# EasyEDA Pro project firefly_xiao.eprj

# Schematic FireFly_xiao

## Sheets
1 PCA
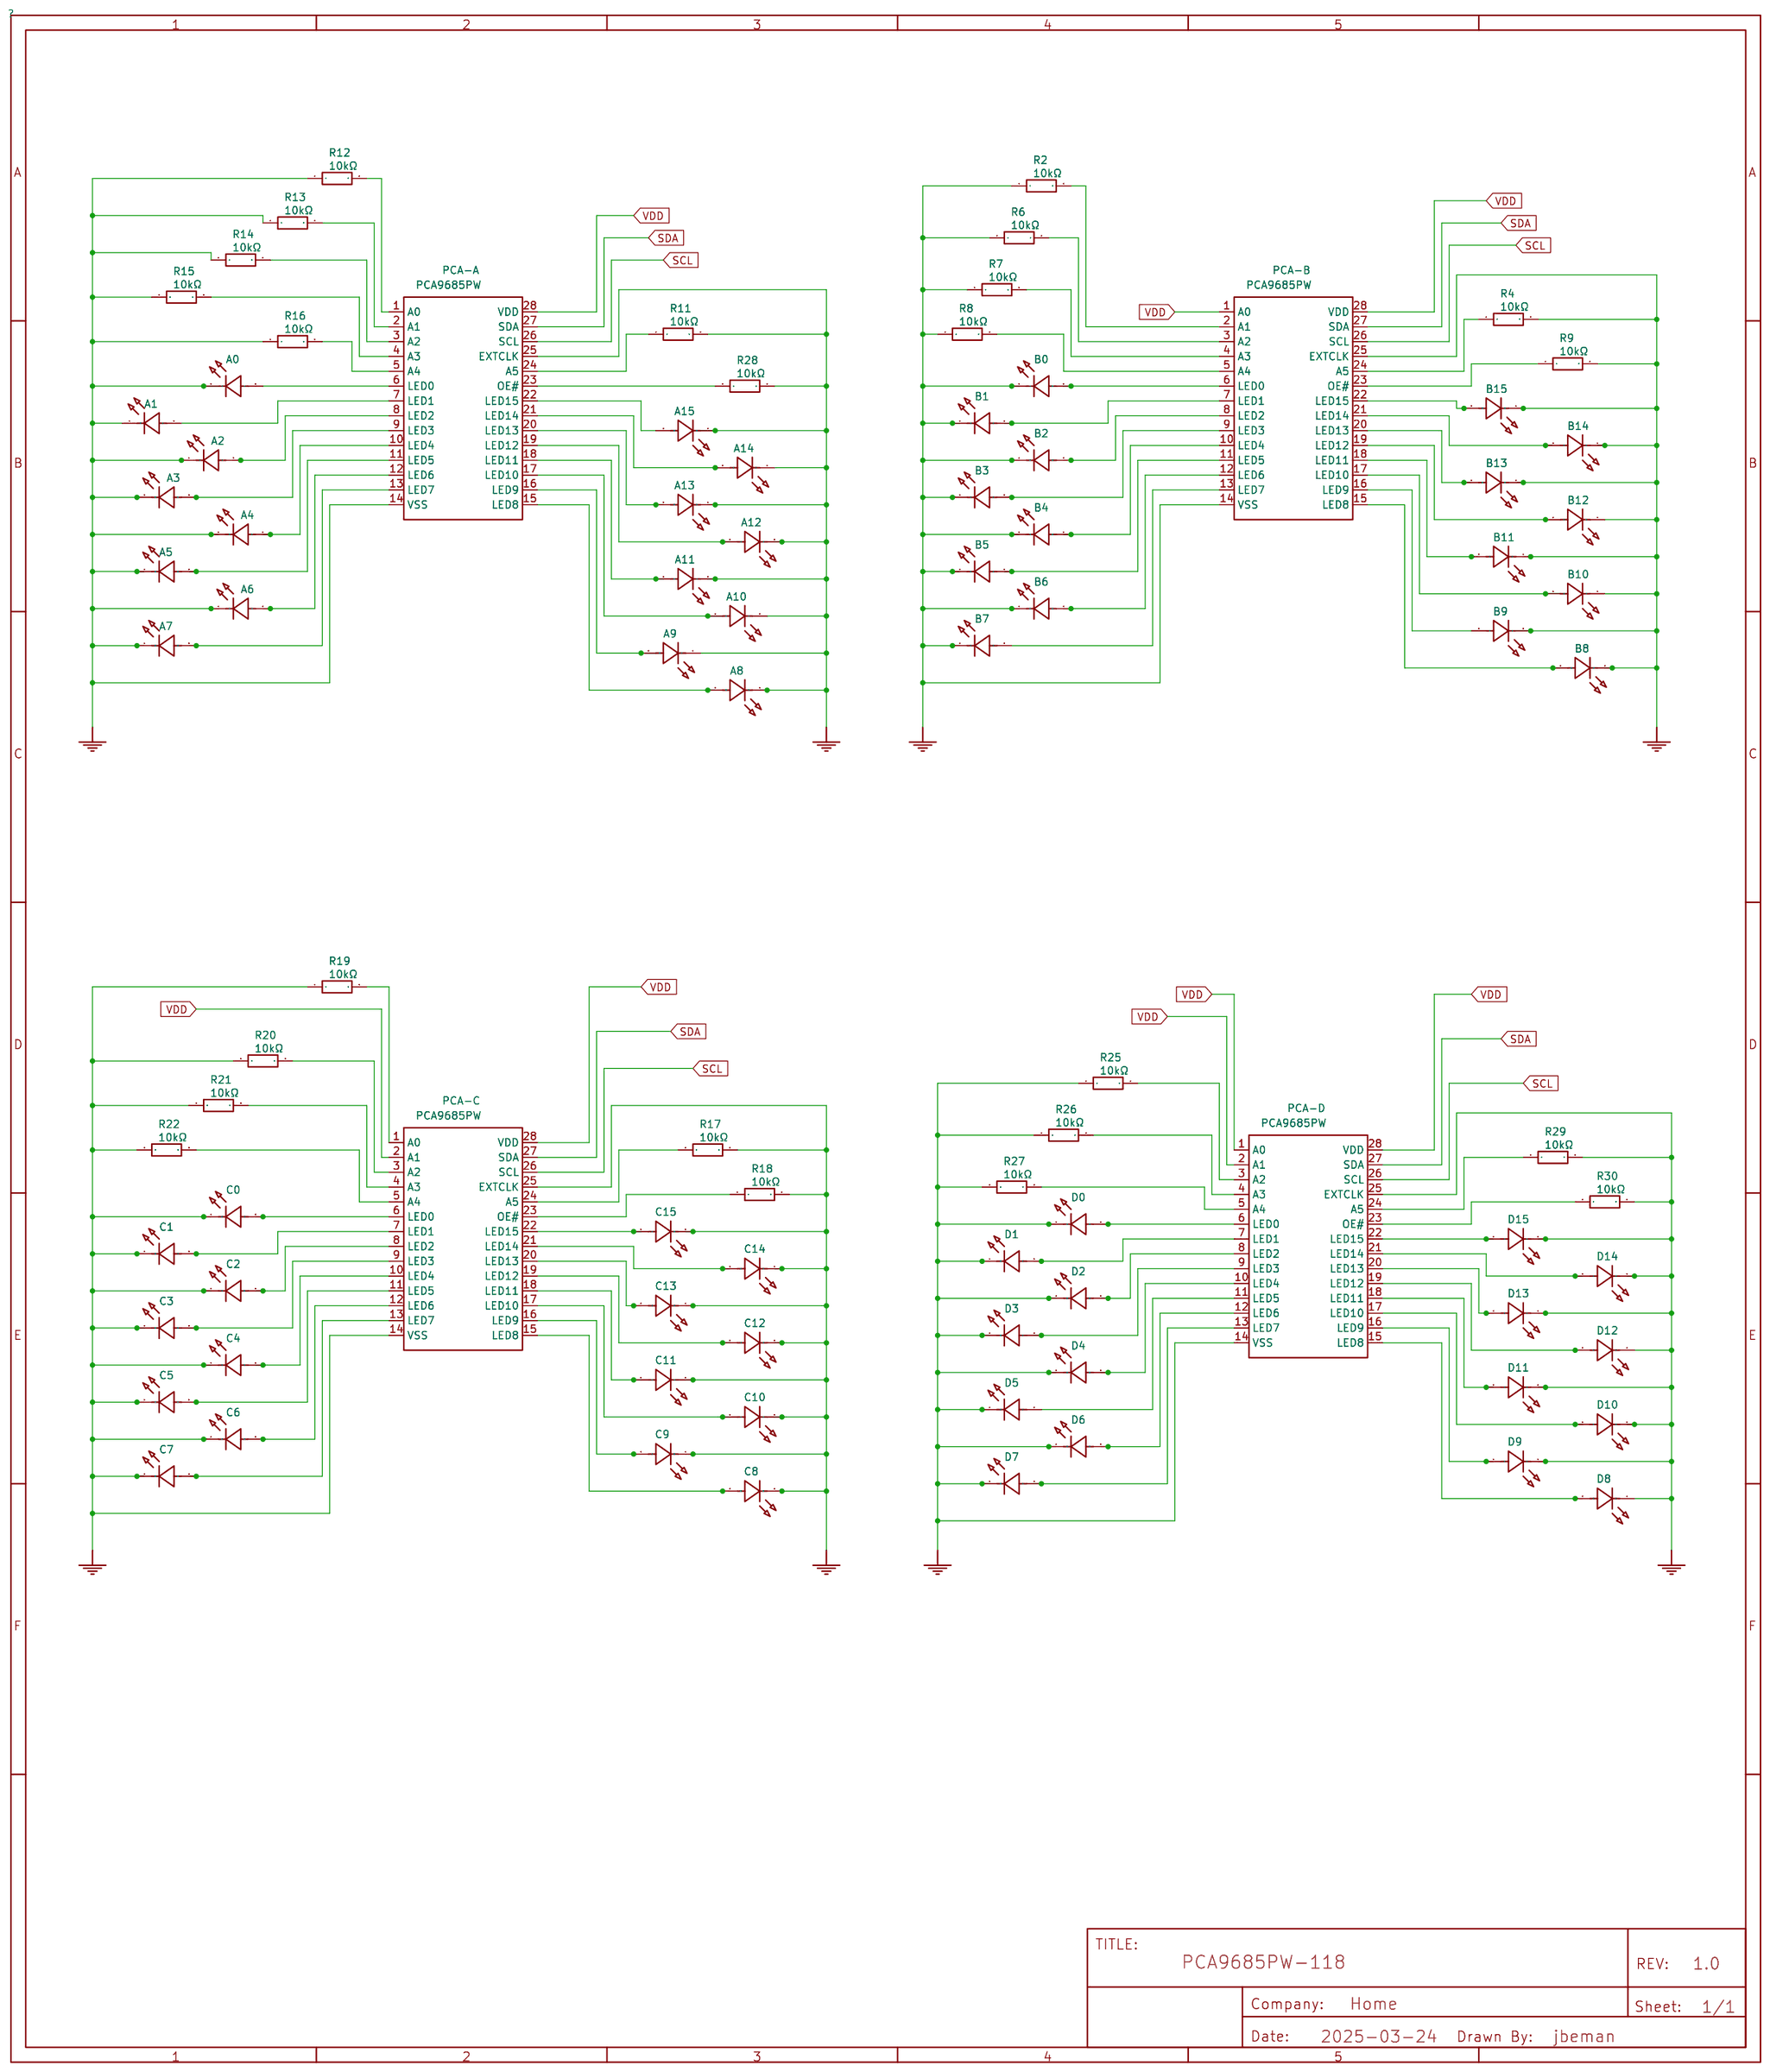
[diagram p0: PCA]
2 Controller: Board Name: FireFly_xiao; Create Date: 2026-03-09; Page Name: Controller; Project Name: firefly_xiao; Schematic Name: FireFly_xiao; Update Date: 2026-03-08; Add into BOM: yes; Company: Home; Convert to PCB: yes; Date: 2025-03-24; Draw By: jbeman; REV: 1.0; Sheet: 1/1; spicePre: .
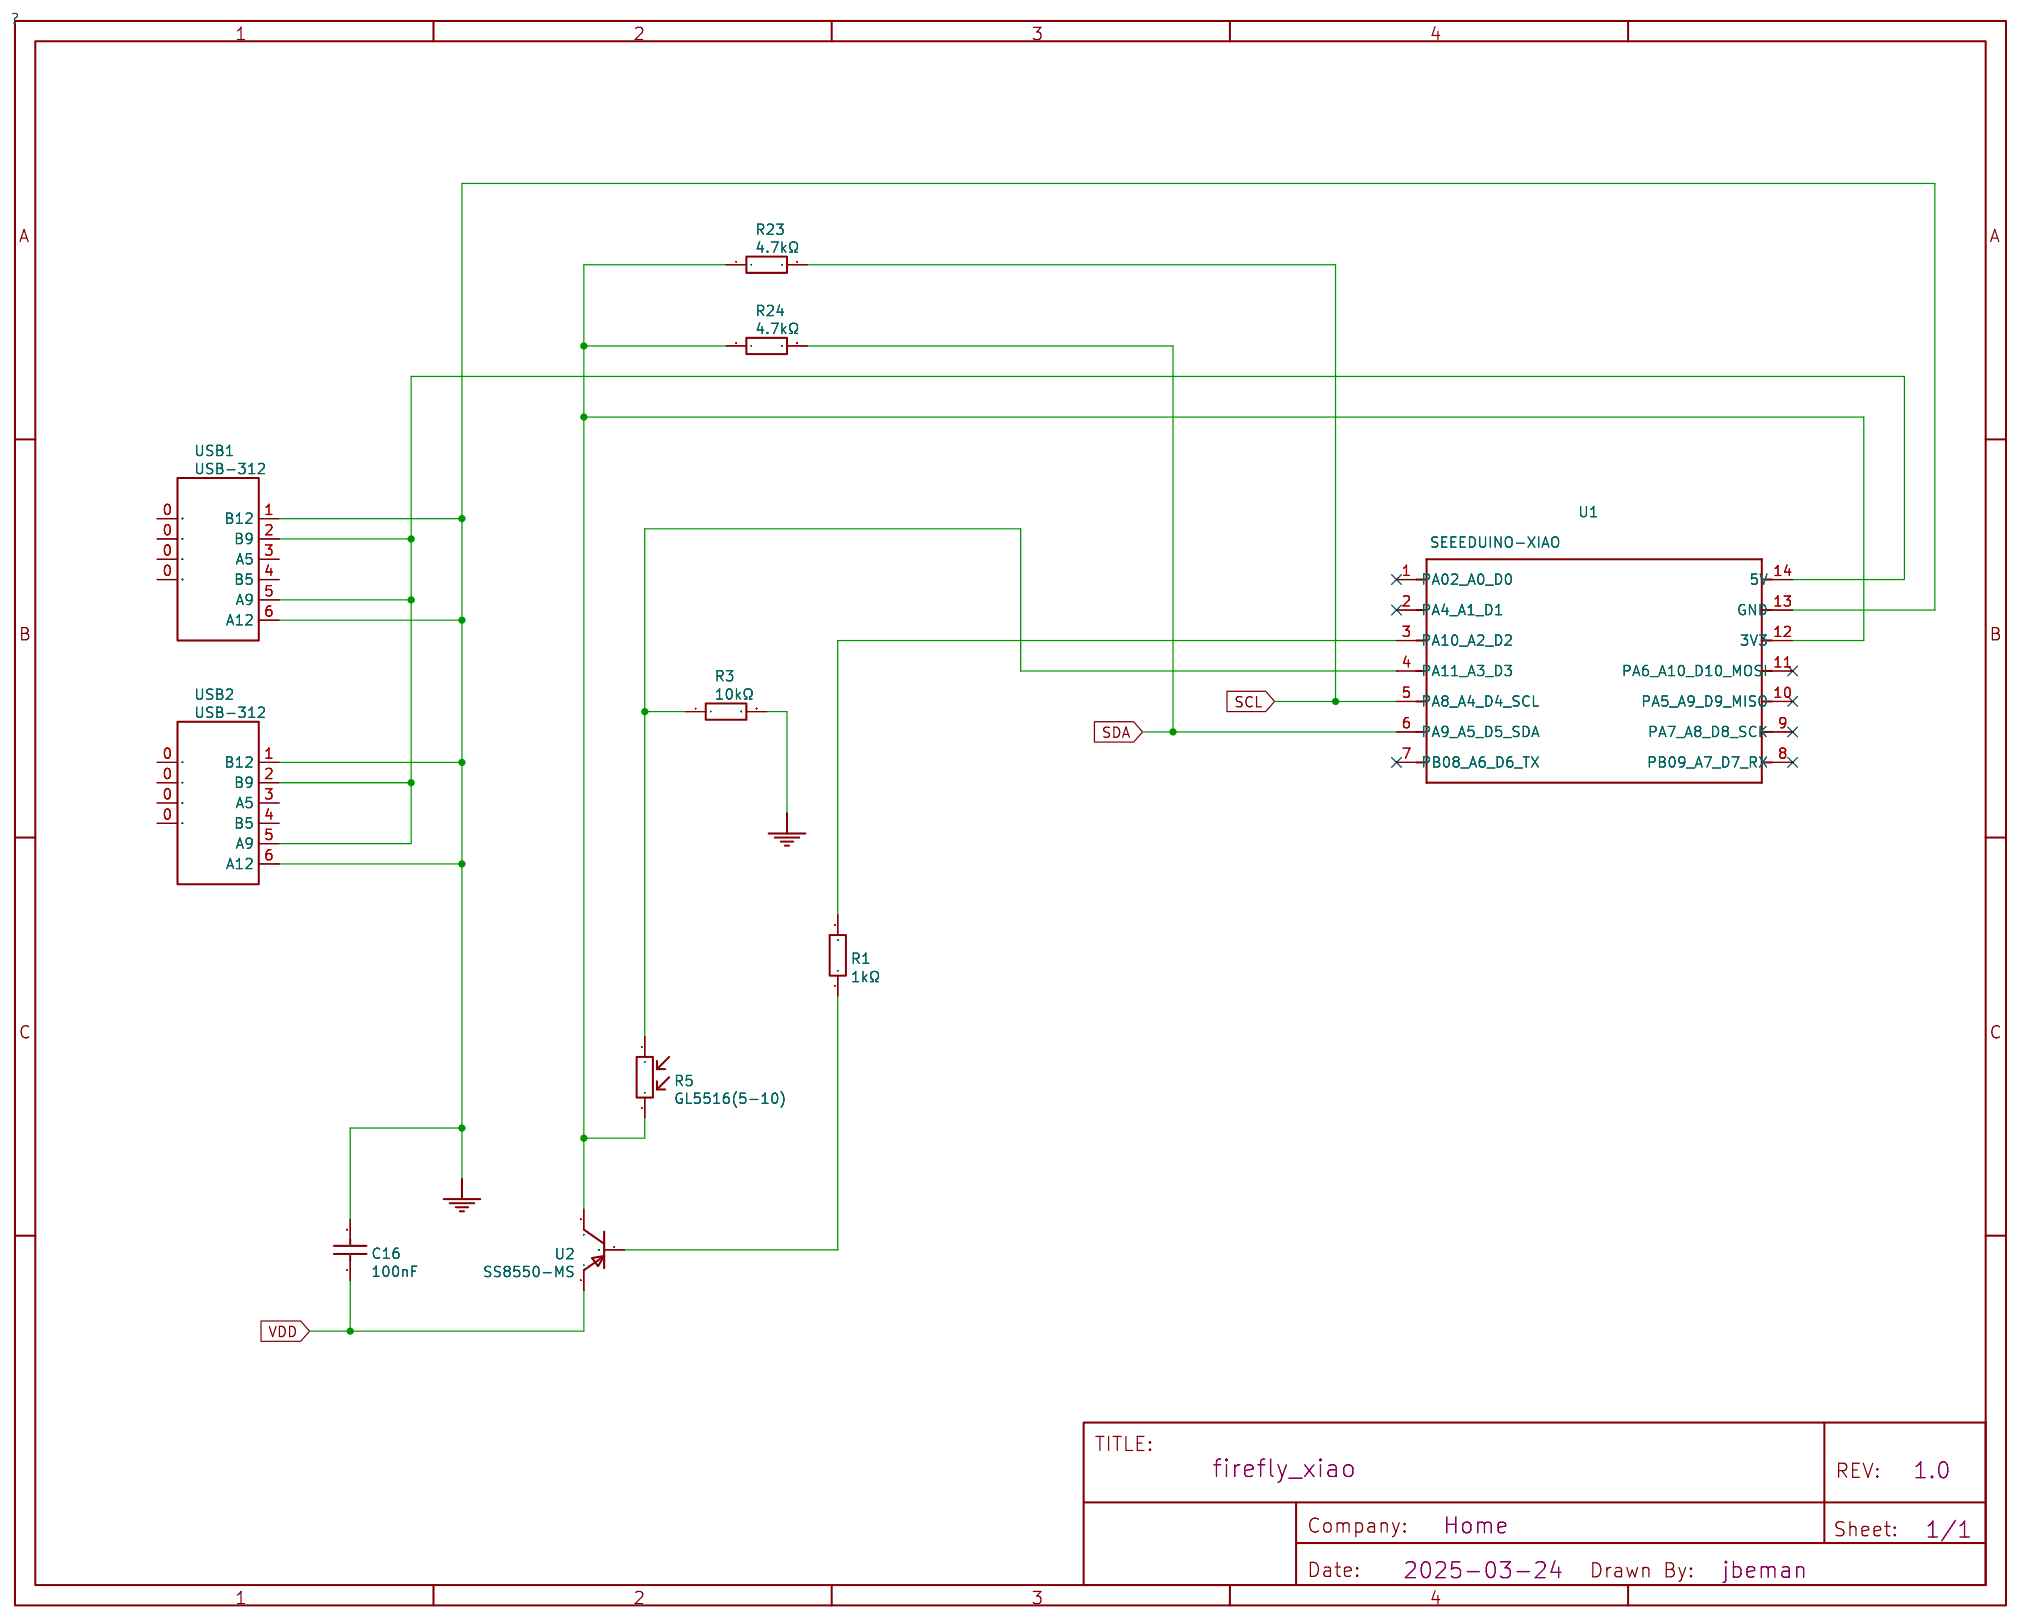
[diagram p1: Controller]

## Parts
sheet Controller
C16  100nF  [C0805]
R1  1kΩ  [R0805]
R3  10kΩ  [R0805]
R5  GL5516(5-10)  [RES-TH_L5.1-W4.3-P3.40_GL55]
R23  4.7kΩ  [R0805]
R24  4.7kΩ  [R0805]
U1  SEEEDUINO-XIAO  [MOUDLE14P-SMD-2.54-21X17.8MM]
U2  SS8550-MS  [SOT-23-3_L2.9-W1.3-P1.90-LS2.4-BR]
USB1  USB-312  [USB-C-SMD_10P-P1.00-L6.8-W8.9]
USB2  USB-312  [USB-C-SMD_10P-P1.00-L6.8-W8.9]
sheet PCA
A0  XL-2012WWC  [LED0805-RD_WHITE]
A1  XL-2012WWC  [LED0805-RD_WHITE]
A2  XL-2012WWC  [LED0805-RD_WHITE]
A3  XL-2012WWC  [LED0805-RD_WHITE]
A4  XL-2012WWC  [LED0805-RD_WHITE]
A5  XL-2012WWC  [LED0805-RD_WHITE]
A6  XL-2012WWC  [LED0805-RD_WHITE]
A7  XL-2012WWC  [LED0805-RD_WHITE]
A8  XL-2012WWC  [LED0805-RD_WHITE]
A9  XL-2012WWC  [LED0805-RD_WHITE]
A10  XL-2012WWC  [LED0805-RD_WHITE]
A11  XL-2012WWC  [LED0805-RD_WHITE]
A12  XL-2012WWC  [LED0805-RD_WHITE]
A13  XL-2012WWC  [LED0805-RD_WHITE]
A14  XL-2012WWC  [LED0805-RD_WHITE]
A15  XL-2012WWC  [LED0805-RD_WHITE]
B0  XL-2012WWC  [LED0805-RD_WHITE]
B1  XL-2012WWC  [LED0805-RD_WHITE]
B2  XL-2012WWC  [LED0805-RD_WHITE]
B3  XL-2012WWC  [LED0805-RD_WHITE]
B4  XL-2012WWC  [LED0805-RD_WHITE]
B5  XL-2012WWC  [LED0805-RD_WHITE]
B6  XL-2012WWC  [LED0805-RD_WHITE]
B7  XL-2012WWC  [LED0805-RD_WHITE]
B8  XL-2012WWC  [LED0805-RD_WHITE]
B9  XL-2012WWC  [LED0805-RD_WHITE]
B10  XL-2012WWC  [LED0805-RD_WHITE]
B11  XL-2012WWC  [LED0805-RD_WHITE]
B12  XL-2012WWC  [LED0805-RD_WHITE]
B13  XL-2012WWC  [LED0805-RD_WHITE]
B14  XL-2012WWC  [LED0805-RD_WHITE]
B15  XL-2012WWC  [LED0805-RD_WHITE]
C0  XL-2012WWC  [LED0805-RD_WHITE]
C1  XL-2012WWC  [LED0805-RD_WHITE]
C2  XL-2012WWC  [LED0805-RD_WHITE]
C3  XL-2012WWC  [LED0805-RD_WHITE]
C4  XL-2012WWC  [LED0805-RD_WHITE]
C5  XL-2012WWC  [LED0805-RD_WHITE]
C6  XL-2012WWC  [LED0805-RD_WHITE]
C7  XL-2012WWC  [LED0805-RD_WHITE]
C8  XL-2012WWC  [LED0805-RD_WHITE]
C9  XL-2012WWC  [LED0805-RD_WHITE]
C10  XL-2012WWC  [LED0805-RD_WHITE]
C11  XL-2012WWC  [LED0805-RD_WHITE]
C12  XL-2012WWC  [LED0805-RD_WHITE]
C13  XL-2012WWC  [LED0805-RD_WHITE]
C14  XL-2012WWC  [LED0805-RD_WHITE]
C15  XL-2012WWC  [LED0805-RD_WHITE]
D0  XL-2012WWC  [LED0805-RD_WHITE]
D1  XL-2012WWC  [LED0805-RD_WHITE]
D2  XL-2012WWC  [LED0805-RD_WHITE]
D3  XL-2012WWC  [LED0805-RD_WHITE]
D4  XL-2012WWC  [LED0805-RD_WHITE]
D5  XL-2012WWC  [LED0805-RD_WHITE]
D6  XL-2012WWC  [LED0805-RD_WHITE]
D7  XL-2012WWC  [LED0805-RD_WHITE]
D8  XL-2012WWC  [LED0805-RD_WHITE]
D9  XL-2012WWC  [LED0805-RD_WHITE]
D10  XL-2012WWC  [LED0805-RD_WHITE]
D11  XL-2012WWC  [LED0805-RD_WHITE]
D12  XL-2012WWC  [LED0805-RD_WHITE]
D13  XL-2012WWC  [LED0805-RD_WHITE]
D14  XL-2012WWC  [LED0805-RD_WHITE]
D15  XL-2012WWC  [LED0805-RD_WHITE]
PCA-A  PCA9685PW  [TSSOP-28_L9.7-W4.4-P0.65-LS6.4-TL]
PCA-B  PCA9685PW  [TSSOP-28_L9.7-W4.4-P0.65-LS6.4-TL]
PCA-C  PCA9685PW  [TSSOP-28_L9.7-W4.4-P0.65-LS6.4-TL]
PCA-D  PCA9685PW  [TSSOP-28_L9.7-W4.4-P0.65-LS6.4-TL]
R2  10kΩ  [R0805]
R4  10kΩ  [R0805]
R6  10kΩ  [R0805]
R7  10kΩ  [R0805]
R8  10kΩ  [R0805]
R9  10kΩ  [R0805]
R11  10kΩ  [R0805]
R12  10kΩ  [R0805]
R13  10kΩ  [R0805]
R14  10kΩ  [R0805]
R15  10kΩ  [R0805]
R16  10kΩ  [R0805]
R17  10kΩ  [R0805]
R18  10kΩ  [R0805]
R19  10kΩ  [R0805]
R20  10kΩ  [R0805]
R21  10kΩ  [R0805]
R22  10kΩ  [R0805]
R25  10kΩ  [R0805]
R26  10kΩ  [R0805]
R27  10kΩ  [R0805]
R28  10kΩ  [R0805]
R29  10kΩ  [R0805]
R30  10kΩ  [R0805]

## Library data of the parts
C16 = 100nF: Supplier: LCSC; Manufacturer Part: CL21B104KCFNNNE; Manufacturer: SAMSUNG(三星); Supplier Part: C28233; JLCPCB Part Class: Basic Part; nameAlias: Value; spicePre: C; spiceSymbolName: CL21B104KCFNNNE
R1 = 1kΩ: Supplier: LCSC; Manufacturer: UNI-ROYAL(厚声); Manufacturer Part: 0805W8F1001T5E; Supplier Part: C17513; JLCPCB Part Class: Basic Part; nameAlias: Value; spicePre: R; spiceSymbolName: 0805W8F1001T5E
R2-R4 R6-R9 R11-R22 R25-R30 = 10kΩ: Supplier: LCSC; Manufacturer: UNI-ROYAL(厚声); Manufacturer Part: 0805W8F1002T5E; Supplier Part: C17414; JLCPCB Part Class: Basic Part; nameAlias: Value; spicePre: R; spiceSymbolName: 0805W8F1002T5E
R5 = GL5516(5-10): Supplier: LCSC; Manufacturer: JCHL(晶创和立); Supplier Part: C10077; JLCPCB Part Class: Extended Part; spicePre: R
R23 R24 = 4.7kΩ: Supplier: LCSC; Manufacturer: UNI-ROYAL(厚声); Manufacturer Part: 0805W8F4701T5E; Supplier Part: C17673; JLCPCB Part Class: Basic Part; nameAlias: Value; spicePre: R; spiceSymbolName: 0805W8F4701T5E
U1 = SEEEDUINO-XIAO: Contributor: jbeman; spicePre: U; spiceSymbolName: MOUDLE-SEEEDUINO-XIAO-SMD
U2 = SS8550-MS: Supplier: LCSC; Supplier Part: C5120747; Manufacturer: MSKSEMI(美森科); JLCPCB Part Class: Extended Part; Contributor: lcsc; spicePre: U
USB1 USB2 = USB-312: Supplier: LCSC; Supplier Part: C309366; Manufacturer: HOOYA(皓宇电子); Manufacturer Part: USB-312-B-SU; JLCPCB Part Class: Extended Part; Contributor: LCSC; spicePre: U
A0-A15 B0-B15 C0-C15 D0-D15 = XL-2012WWC: Supplier: LCSC; Supplier Part: C965820; Manufacturer: XINGLIGHT(成兴光); JLCPCB Part Class: Extended Part; Contributor: lcsc; spicePre: L
PCA-A PCA-B PCA-C PCA-D = PCA9685PW: Supplier: LCSC; Supplier Part: C2678753; Manufacturer: NXP(恩智浦); Manufacturer Part: PCA9685PW,118; JLCPCB Part Class: Extended Part; Contributor: LCSC; nameAlias: Value; spicePre: U; spiceSymbolName: PCA9685PW,118

## Nets
GND: A0.1(K) A1.1(K) A2.1(K) A3.1(K) A4.1(K) A5.1(K) A6.1(K) A7.1(K) A8.1(K) A9.1(K) A10.1(K) A11.1(K) A12.1(K) A13.1(K) A14.1(K) A15.1(K) B0.1(K) B1.1(K) B2.1(K) B3.1(K) B4.1(K) B5.1(K) B6.1(K) B7.1(K) B8.1(K) B9.1(K) B10.1(K) B11.1(K) B12.1(K) B13.1(K) B14.1(K) B15.1(K) C0.1(K) C1.1(K) C2.1(K) C3.1(K) C4.1(K) C5.1(K) C6.1(K) C7.1(K) C8.1(K) C9.1(K) C10.1(K) C11.1(K) C12.1(K) C13.1(K) C14.1(K) C15.1(K) C16.2 D0.1(K) D1.1(K) D2.1(K) D3.1(K) D4.1(K) D5.1(K) D6.1(K) D7.1(K) D8.1(K) D9.1(K) D10.1(K) D11.1(K) D12.1(K) D13.1(K) D14.1(K) D15.1(K) PCA-A.14(VSS) PCA-A.25(EXTCLK) PCA-B.14(VSS) PCA-B.25(EXTCLK) PCA-C.14(VSS) PCA-C.25(EXTCLK) PCA-D.14(VSS) PCA-D.25(EXTCLK) R2.1 R3.2 R4.2 R6.1 R7.1 R8.1 R9.2 R11.2 R12.1 R13.1 R14.1 R15.1 R16.1 R17.2 R18.2 R19.1 R20.1 R21.1 R22.1 R25.1 R26.1 R27.1 R28.2 R29.2 R30.2 U1.13(GND) USB1.1(B12) USB1.6(A12) USB2.1(B12) USB2.6(A12)
VDD: C16.1 PCA-A.28(VDD) PCA-B.1(A0) PCA-B.28(VDD) PCA-C.2(A1) PCA-C.28(VDD) PCA-D.1(A0) PCA-D.2(A1) PCA-D.28(VDD) U2.2(E)
SCL: PCA-A.26(SCL) PCA-B.26(SCL) PCA-C.26(SCL) PCA-D.26(SCL) R23.2 U1.5(PA8_A4_D4_SCL)
SDA: PCA-A.27(SDA) PCA-B.27(SDA) PCA-C.27(SDA) PCA-D.27(SDA) R24.2 U1.6(PA9_A5_D5_SDA)
PCA-A_1: PCA-A.1(A0) R12.2
PCA-A_2: PCA-A.2(A1) R13.2
PCA-A_3: PCA-A.3(A2) R14.2
PCA-A_4: PCA-A.4(A3) R15.2
PCA-A_5: PCA-A.5(A4) R16.2
PCA-A_6: A0.2(A) PCA-A.6(LED0)
PCA-A_7: A1.2(A) PCA-A.7(LED1)
PCA-A_8: A2.2(A) PCA-A.8(LED2)
PCA-A_9: A3.2(A) PCA-A.9(LED3)
PCA-A_10: A4.2(A) PCA-A.10(LED4)
PCA-A_11: A5.2(A) PCA-A.11(LED5)
PCA-A_12: A6.2(A) PCA-A.12(LED6)
PCA-A_13: A7.2(A) PCA-A.13(LED7)
PCA-A_15: A8.2(A) PCA-A.15(LED8)
PCA-A_16: A9.2(A) PCA-A.16(LED9)
PCA-A_17: A10.2(A) PCA-A.17(LED10)
PCA-A_18: A11.2(A) PCA-A.18(LED11)
PCA-A_19: A12.2(A) PCA-A.19(LED12)
PCA-A_20: A13.2(A) PCA-A.20(LED13)
PCA-A_21: A14.2(A) PCA-A.21(LED14)
PCA-A_22: A15.2(A) PCA-A.22(LED15)
PCA-A_23: PCA-A.23(OE#) R28.1
PCA-A_24: PCA-A.24(A5) R11.1
PCA-B_2: PCA-B.2(A1) R2.2
PCA-B_3: PCA-B.3(A2) R6.2
PCA-B_4: PCA-B.4(A3) R7.2
PCA-B_5: PCA-B.5(A4) R8.2
PCA-B_6: B0.2(A) PCA-B.6(LED0)
PCA-B_7: B1.2(A) PCA-B.7(LED1)
PCA-B_8: B2.2(A) PCA-B.8(LED2)
PCA-B_9: B3.2(A) PCA-B.9(LED3)
PCA-B_10: B4.2(A) PCA-B.10(LED4)
PCA-B_11: B5.2(A) PCA-B.11(LED5)
PCA-B_12: B6.2(A) PCA-B.12(LED6)
PCA-B_13: B7.2(A) PCA-B.13(LED7)
PCA-B_15: B8.2(A) PCA-B.15(LED8)
PCA-B_16: B9.2(A) PCA-B.16(LED9)
PCA-B_17: B10.2(A) PCA-B.17(LED10)
PCA-B_18: B11.2(A) PCA-B.18(LED11)
PCA-B_19: B12.2(A) PCA-B.19(LED12)
PCA-B_20: B13.2(A) PCA-B.20(LED13)
PCA-B_21: B14.2(A) PCA-B.21(LED14)
PCA-B_22: B15.2(A) PCA-B.22(LED15)
PCA-B_23: PCA-B.23(OE#) R9.1
PCA-B_24: PCA-B.24(A5) R4.1
PCA-C_1: PCA-C.1(A0) R19.2
PCA-C_3: PCA-C.3(A2) R20.2
PCA-C_4: PCA-C.4(A3) R21.2
PCA-C_5: PCA-C.5(A4) R22.2
PCA-C_6: C0.2(A) PCA-C.6(LED0)
PCA-C_7: C1.2(A) PCA-C.7(LED1)
PCA-C_8: C2.2(A) PCA-C.8(LED2)
PCA-C_9: C3.2(A) PCA-C.9(LED3)
PCA-C_10: C4.2(A) PCA-C.10(LED4)
PCA-C_11: C5.2(A) PCA-C.11(LED5)
PCA-C_12: C6.2(A) PCA-C.12(LED6)
PCA-C_13: C7.2(A) PCA-C.13(LED7)
PCA-C_15: C8.2(A) PCA-C.15(LED8)
PCA-C_16: C9.2(A) PCA-C.16(LED9)
PCA-C_17: C10.2(A) PCA-C.17(LED10)
PCA-C_18: C11.2(A) PCA-C.18(LED11)
PCA-C_19: C12.2(A) PCA-C.19(LED12)
PCA-C_20: C13.2(A) PCA-C.20(LED13)
PCA-C_21: C14.2(A) PCA-C.21(LED14)
PCA-C_22: C15.2(A) PCA-C.22(LED15)
PCA-C_23: PCA-C.23(OE#) R18.1
PCA-C_24: PCA-C.24(A5) R17.1
PCA-D_3: PCA-D.3(A2) R25.2
PCA-D_4: PCA-D.4(A3) R26.2
PCA-D_5: PCA-D.5(A4) R27.2
PCA-D_6: D0.2(A) PCA-D.6(LED0)
PCA-D_7: D1.2(A) PCA-D.7(LED1)
PCA-D_8: D2.2(A) PCA-D.8(LED2)
PCA-D_9: D3.2(A) PCA-D.9(LED3)
PCA-D_10: D4.2(A) PCA-D.10(LED4)
PCA-D_11: D5.2(A) PCA-D.11(LED5)
PCA-D_12: D6.2(A) PCA-D.12(LED6)
PCA-D_13: D7.2(A) PCA-D.13(LED7)
PCA-D_15: D8.2(A) PCA-D.15(LED8)
PCA-D_16: D9.2(A) PCA-D.16(LED9)
PCA-D_17: D10.2(A) PCA-D.17(LED10)
PCA-D_18: D11.2(A) PCA-D.18(LED11)
PCA-D_19: D12.2(A) PCA-D.19(LED12)
PCA-D_20: D13.2(A) PCA-D.20(LED13)
PCA-D_21: D14.2(A) PCA-D.21(LED14)
PCA-D_22: D15.2(A) PCA-D.22(LED15)
PCA-D_23: PCA-D.23(OE#) R30.1
PCA-D_24: PCA-D.24(A5) R29.1
R1_2: R1.2 U1.3(PA10_A2_D2)
R5_1: R3.1 R5.1 U1.4(PA11_A3_D3)
R5_2: R5.2 R23.1 R24.1 U1.12(3V3) U2.3(C)
U2_1: R1.1 U2.1(B)
USB1_2: U1.14(5V) USB1.2(B9) USB1.5(A9) USB2.2(B9) USB2.5(A9)

Not connected (* = marked no-connect by the designer): U1 1(PA02_A0_D0)* 2(PA4_A1_D1)* 7(PB08_A6_D6_TX)* 8(PB09_A7_D7_RX)* 9(PA7_A8_D8_SCK)* 10(PA5_A9_D9_MISO)* 11(PA6_A10_D10_MOSI)*; USB1 0 3(A5) 4(B5); USB2 0 3(A5) 4(B5)

# Board 1-PCB_PCB_FireFly_xiao
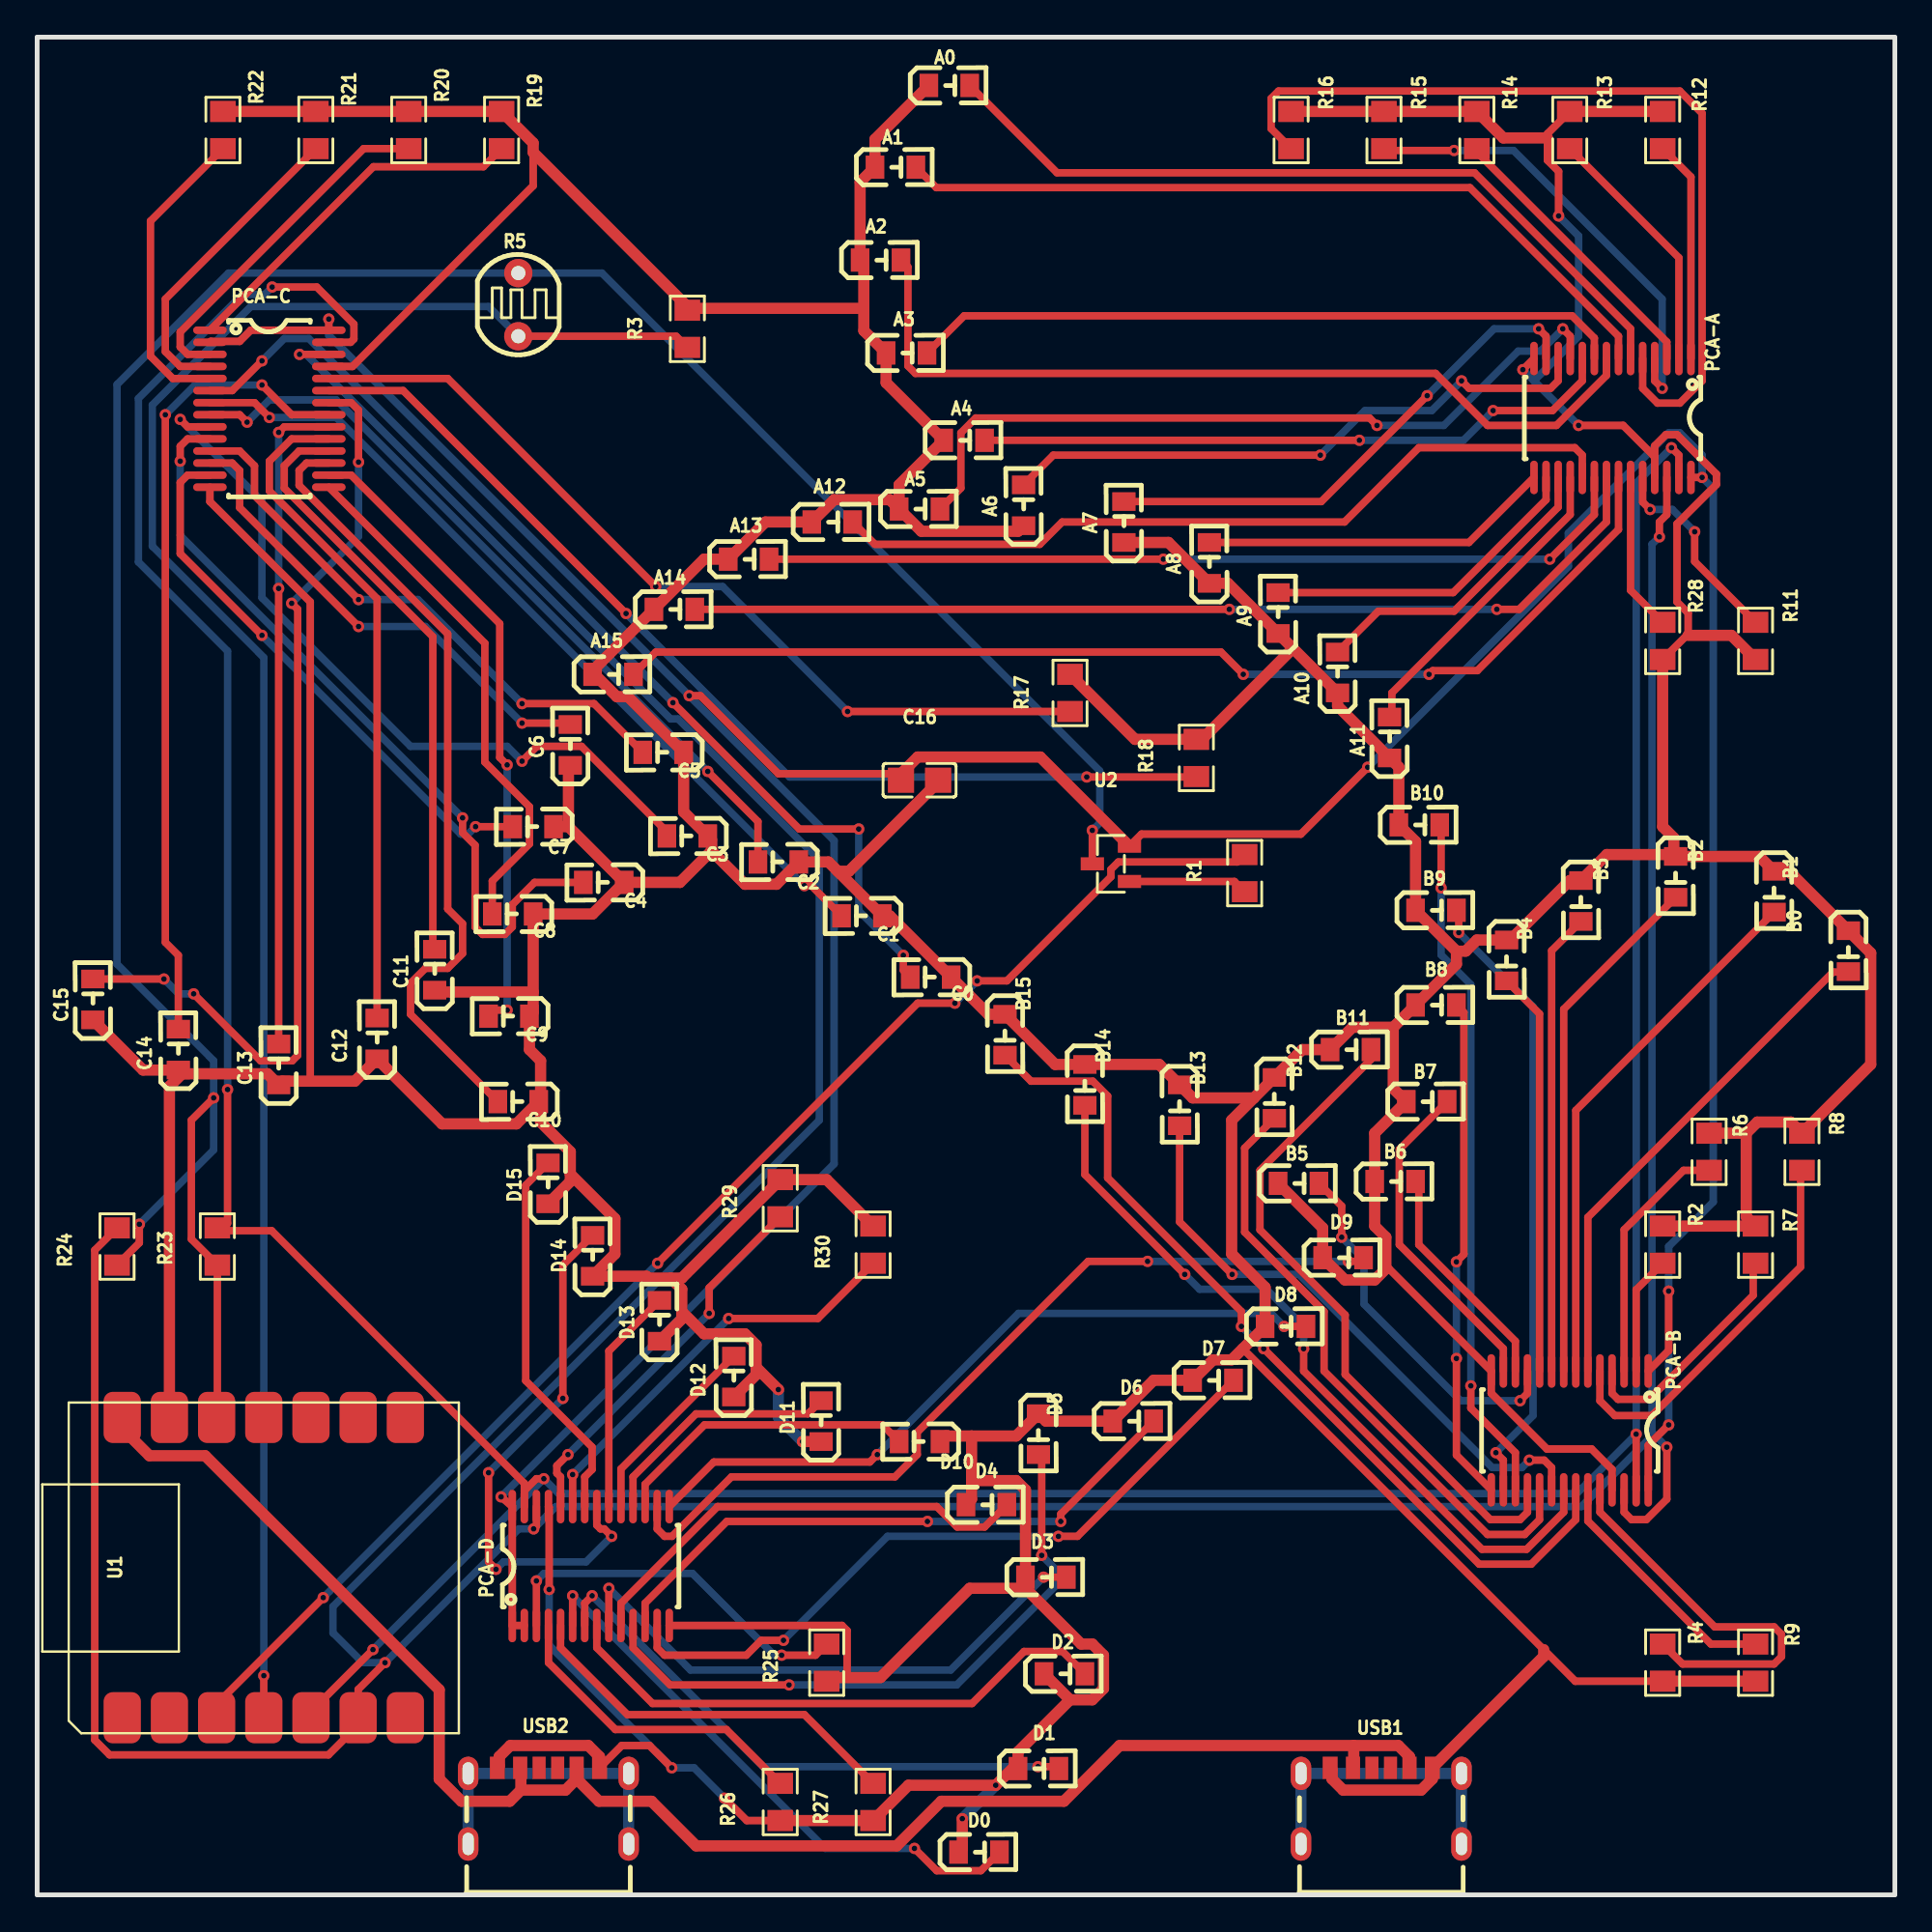
[diagram p2: board, top side]
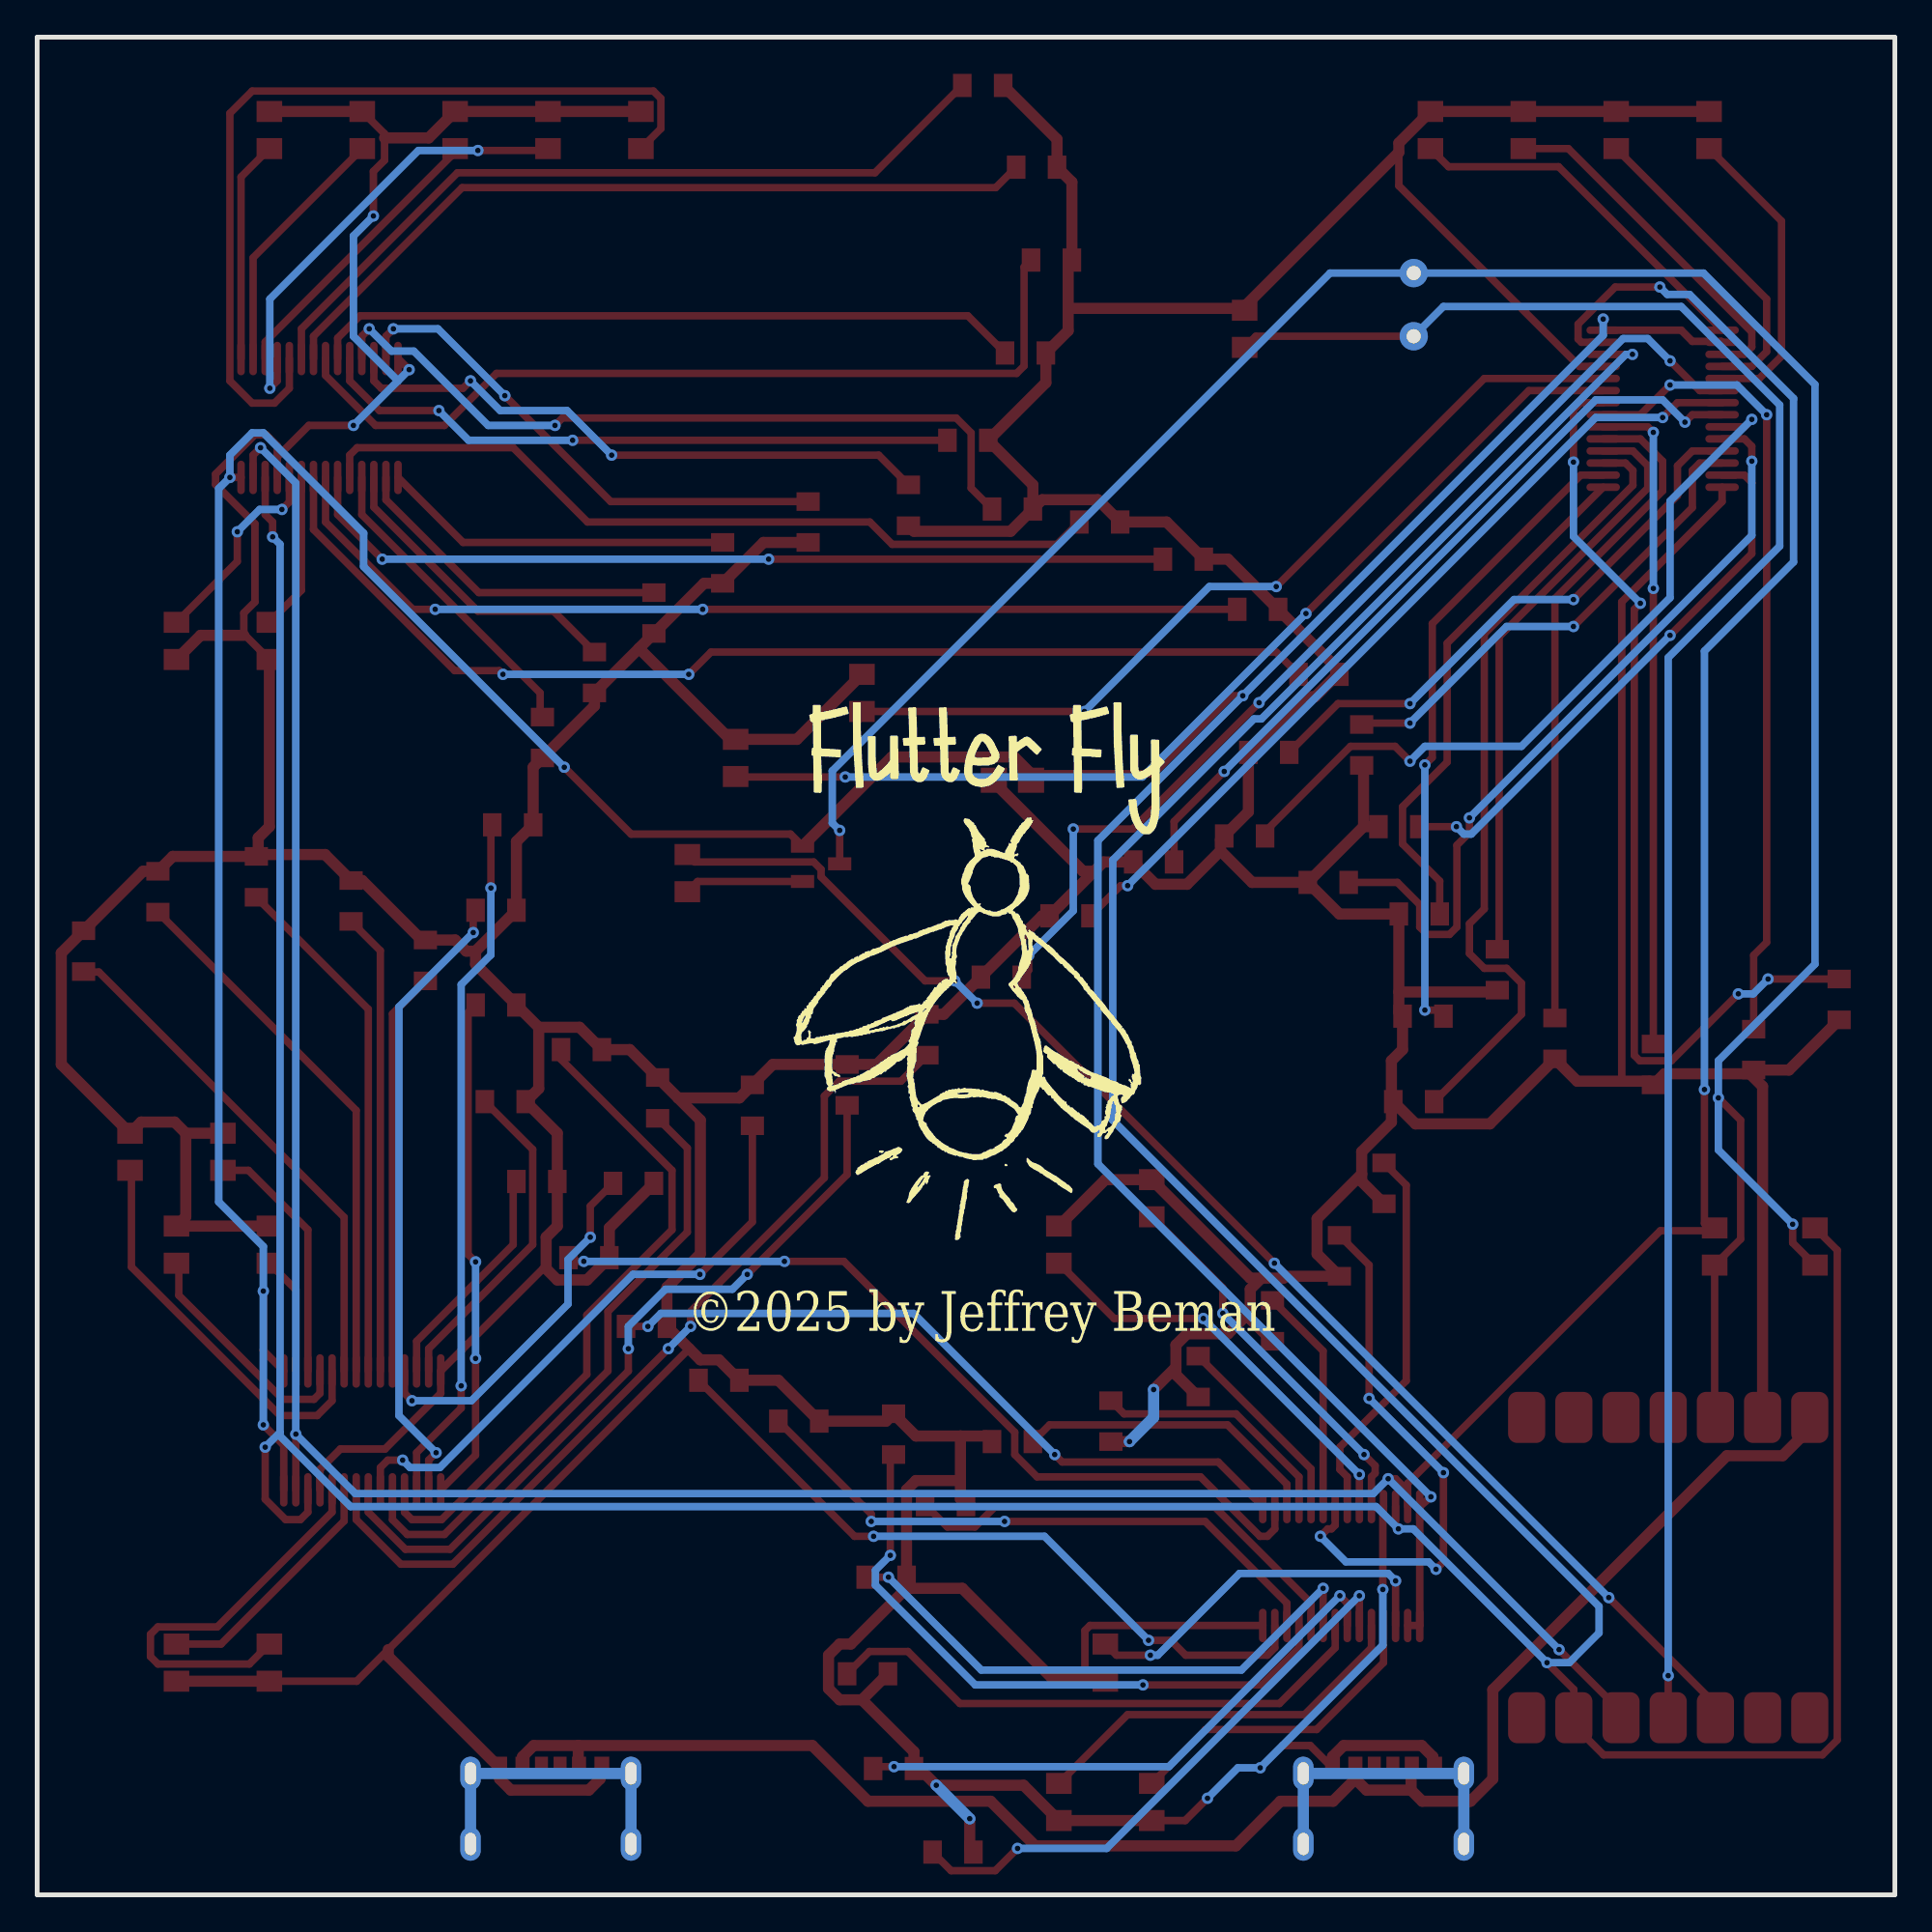
[diagram p3: board, bottom side, seen from below]

Outline 100 x 100 mm; copper layers: Top Layer, Bottom Layer. Coordinates in mm from the lower left corner of the outline.
Outline path: 0,100 100,100 100,0 0,0 0,100
Stack: Top Layer 0.035mm / Dielectric1 1.51mm FR4 er 4.5 / Bottom Layer 0.035mm

## Design rules (mm)
template: User Custom Config
spacing Default (default): track to track 0.102, other pairs 0.152 to 0.3
track width Default (default): min 0.127, default 0.4, max 2.54
track width PowerTrack: min 0.4, default 0.6, max 2.54
differential pair differentialPair (default): width min 0.127, default 0.254, max 2.54; gap min 0.152, default 0.152
via Default (default): diameter min 0.61, default 0.61, max 100.025; hole min 0.305, default 0.305, max 59.995
net GND uses PowerTrack
net VDD uses PowerTrack
net USB2_0 uses PowerTrack
net USB1_0 uses PowerTrack
net USB1_2 uses PowerTrack
net USB1_4 uses PowerTrack
net USB1_3 uses PowerTrack
net USB2_4 uses PowerTrack
net USB2_3 uses PowerTrack

## Placement (name value [footprint] x y rotation side)
A0  XL-2012WWC  [LED0805-RD_WHITE]  49.1 97.4 0 top
A1  XL-2012WWC  [LED0805-RD_WHITE]  46.2 93 0 top
A2  XL-2012WWC  [LED0805-RD_WHITE]  45.4 88 0 top
A3  XL-2012WWC  [LED0805-RD_WHITE]  46.8 83 0 top
A4  XL-2012WWC  [LED0805-RD_WHITE]  49.9 78.3 0 top
A5  XL-2012WWC  [LED0805-RD_WHITE]  47.5 74.6 0 top
A6  XL-2012WWC  [LED0805-RD_WHITE]  53.1 74.8 90 top
A7  XL-2012WWC  [LED0805-RD_WHITE]  58.5 73.9 90 top
A8  XL-2012WWC  [LED0805-RD_WHITE]  63.1 71.7 90 top
A9  XL-2012WWC  [LED0805-RD_WHITE]  66.8 69 90 top
A10  XL-2012WWC  [LED0805-RD_WHITE]  70 65.8 90 top
A11  XL-2012WWC  [LED0805-RD_WHITE]  72.8 62.3 90 top
A12  XL-2012WWC  [LED0805-RD_WHITE]  42.8 73.9 0 top
A13  XL-2012WWC  [LED0805-RD_WHITE]  38.3 71.9 0 top
A14  XL-2012WWC  [LED0805-RD_WHITE]  34.3 69.2 0 top
A15  XL-2012WWC  [LED0805-RD_WHITE]  31 65.7 0 top
B0  XL-2012WWC  [LED0805-RD_WHITE]  97.5 50.8 270 top
B1  XL-2012WWC  [LED0805-RD_WHITE]  93.5 54 270 top
B2  XL-2012WWC  [LED0805-RD_WHITE]  88.2 54.8 270 top
B3  XL-2012WWC  [LED0805-RD_WHITE]  83.1 53.5 270 top
B4  XL-2012WWC  [LED0805-RD_WHITE]  79.1 50.3 270 top
B5  XL-2012WWC  [LED0805-RD_WHITE]  67.9 38.3 0 top
B6  XL-2012WWC  [LED0805-RD_WHITE]  73.1 38.4 0 top
B7  XL-2012WWC  [LED0805-RD_WHITE]  74.8 42.7 0 top
B8  XL-2012WWC  [LED0805-RD_WHITE]  75.3 47.9 0 top
B9  XL-2012WWC  [LED0805-RD_WHITE]  75.3 53 0 top
B10  XL-2012WWC  [LED0805-RD_WHITE]  74.4 57.6 0 top
B11  XL-2012WWC  [LED0805-RD_WHITE]  70.7 45.5 0 top
B12  XL-2012WWC  [LED0805-RD_WHITE]  66.6 42.9 270 top
B13  XL-2012WWC  [LED0805-RD_WHITE]  61.5 42.5 270 top
B14  XL-2012WWC  [LED0805-RD_WHITE]  56.4 43.6 270 top
B15  XL-2012WWC  [LED0805-RD_WHITE]  52.1 46.3 270 top
C0  XL-2012WWC  [LED0805-RD_WHITE]  48.1 49.4 180 top
C1  XL-2012WWC  [LED0805-RD_WHITE]  44.4 52.7 180 top
C2  XL-2012WWC  [LED0805-RD_WHITE]  39.9 55.6 180 top
C3  XL-2012WWC  [LED0805-RD_WHITE]  35 57 180 top
C4  XL-2012WWC  [LED0805-RD_WHITE]  30.5 54.5 180 top
C5  XL-2012WWC  [LED0805-RD_WHITE]  33.7 61.5 180 top
C6  XL-2012WWC  [LED0805-RD_WHITE]  28.7 61.9 90 top
C7  XL-2012WWC  [LED0805-RD_WHITE]  26.7 57.5 180 top
C8  XL-2012WWC  [LED0805-RD_WHITE]  25.6 52.8 180 top
C9  XL-2012WWC  [LED0805-RD_WHITE]  25.4 47.3 180 top
C10  XL-2012WWC  [LED0805-RD_WHITE]  25.9 42.7 180 top
C11  XL-2012WWC  [LED0805-RD_WHITE]  21.4 49.8 90 top
C12  XL-2012WWC  [LED0805-RD_WHITE]  18.3 46.1 90 top
C13  XL-2012WWC  [LED0805-RD_WHITE]  13 44.7 90 top
C14  XL-2012WWC  [LED0805-RD_WHITE]  7.6 45.5 90 top
C15  XL-2012WWC  [LED0805-RD_WHITE]  3 48.2 90 top
C16  100nF  [C0805]  47.5 60 0 top
D0  XL-2012WWC  [LED0805-RD_WHITE]  50.7 2.3 0 top
D1  XL-2012WWC  [LED0805-RD_WHITE]  53.9 6.8 0 top
D2  XL-2012WWC  [LED0805-RD_WHITE]  55.3 11.9 0 top
D3  XL-2012WWC  [LED0805-RD_WHITE]  54.3 17.1 0 top
D4  XL-2012WWC  [LED0805-RD_WHITE]  51.1 21 0 top
D5  XL-2012WWC  [LED0805-RD_WHITE]  53.9 24.8 270 top
D6  XL-2012WWC  [LED0805-RD_WHITE]  59 25.5 0 top
D7  XL-2012WWC  [LED0805-RD_WHITE]  63.3 27.7 0 top
D8  XL-2012WWC  [LED0805-RD_WHITE]  67.2 30.6 0 top
D9  XL-2012WWC  [LED0805-RD_WHITE]  70.3 34.3 0 top
D10  XL-2012WWC  [LED0805-RD_WHITE]  47.5 24.4 180 top
D11  XL-2012WWC  [LED0805-RD_WHITE]  42.2 25.5 90 top
D12  XL-2012WWC  [LED0805-RD_WHITE]  37.5 27.9 90 top
D13  XL-2012WWC  [LED0805-RD_WHITE]  33.5 30.9 90 top
D14  XL-2012WWC  [LED0805-RD_WHITE]  29.9 34.4 90 top
D15  XL-2012WWC  [LED0805-RD_WHITE]  27.5 38.3 90 top
PCA-A  PCA9685PW  [TSSOP-28_L9.7-W4.4-P0.65-LS6.4-TL]  84.8 79.5 270 top
PCA-B  PCA9685PW  [TSSOP-28_L9.7-W4.4-P0.65-LS6.4-TL]  82.5 25 270 top
PCA-C  PCA9685PW  [TSSOP-28_L9.7-W4.4-P0.65-LS6.4-TL]  12.5 80 0 top
PCA-D  PCA9685PW  [TSSOP-28_L9.7-W4.4-P0.65-LS6.4-TL]  29.8 17.7 90 top
R1  1kΩ  [R0805]  65 55 90 top
R2  10kΩ  [R0805]  87.5 35 270 top
R3  10kΩ  [R0805]  35 84.3 90 top
R4  10kΩ  [R0805]  87.5 12.5 270 top
R5  GL5516(5-10)  [RES-TH_L5.1-W4.3-P3.40_GL55]  25.9 85.6 180 top
R6  10kΩ  [R0805]  90 40 270 top
R7  10kΩ  [R0805]  92.5 35 270 top
R8  10kΩ  [R0805]  95 40 270 top
R9  10kΩ  [R0805]  92.5 12.5 270 top
R11  10kΩ  [R0805]  92.5 67.5 270 top
R12  10kΩ  [R0805]  87.5 95 270 top
R13  10kΩ  [R0805]  82.5 95 270 top
R14  10kΩ  [R0805]  77.5 95 270 top
R15  10kΩ  [R0805]  72.5 95 270 top
R16  10kΩ  [R0805]  67.5 95 270 top
R17  10kΩ  [R0805]  55.6 64.7 90 top
R18  10kΩ  [R0805]  62.4 61.2 90 top
R19  10kΩ  [R0805]  25 95 270 top
R20  10kΩ  [R0805]  20 95 270 top
R21  10kΩ  [R0805]  15 95 270 top
R22  10kΩ  [R0805]  10 95 270 top
R23  4.7kΩ  [R0805]  9.7 34.9 90 top
R24  4.7kΩ  [R0805]  4.3 34.9 90 top
R25  10kΩ  [R0805]  42.5 12.5 90 top
R26  10kΩ  [R0805]  40 5 90 top
R27  10kΩ  [R0805]  45 5 90 top
R28  10kΩ  [R0805]  87.5 67.5 270 top
R29  10kΩ  [R0805]  40 37.5 90 top
R30  10kΩ  [R0805]  45 35 90 top
U1  SEEEDUINO-XIAO  [MOUDLE14P-SMD-2.54-21X17.8MM]  22.7 8.7 90 top
U2  SS8550-MS  [SOT-23-3_L2.9-W1.3-P1.90-LS2.4-BR]  57.8 55.5 0 top
USB1  USB-312  [USB-C-SMD_10P-P1.00-L6.8-W8.9]  72.35 4.79 0 top
USB2  USB-312  [USB-C-SMD_10P-P1.00-L6.8-W8.9]  27.52 4.79 0 top

## Footprints (pads in the part's own frame, mm; a bottom-side part is the same pattern mirrored in y, then rotated)
C0805
  rect 1.41x1.35 smd: 1(-1,0) 2(1,0)
LED0805-RD_WHITE
  rect 1x1.25 smd: 1(-1.1,0) 2(1.1,0)
MOUDLE14P-SMD-2.54-21X17.8MM
  custom 2.75x2 smd: 1(0.835,18.12) 2(0.835,15.58) 3(0.835,13.04) 4(0.835,10.5) 5(0.835,7.96) 6(0.835,5.42) 7(0.835,2.88) 8(17,2.88) 9(17,5.42) 10(17,7.96) 11(17,10.5) 12(17,13.04) 13(17,15.58) 14(17,18.12)
R0805
  rect 1.133x1.377 smd: 1(-1,0) 2(1,0)
RES-TH_L5.1-W4.3-P3.40_GL55
  round 1.524 hole 0.762: 1(0,1.7) 2(0,-1.7)
SOT-23-3_L2.9-W1.3-P1.90-LS2.4-BR
  rect 1.25x0.7 smd: 1(1,-0.95) 2(1,0.95) 3(-1,0)
TSSOP-28_L9.7-W4.4-P0.65-LS6.4-TL
  oval 1.804x0.406 smd: 1(-3.2,4.225) 2(-3.2,3.575) 3(-3.2,2.925) 4(-3.2,2.275) 5(-3.2,1.625) 6(-3.2,0.975) 7(-3.2,0.325) 8(-3.2,-0.325) 9(-3.2,-0.975) 10(-3.2,-1.625) 11(-3.2,-2.275) 12(-3.2,-2.925) 13(-3.2,-3.575) 14(-3.2,-4.225) 15(3.2,-4.225) 16(3.2,-3.575) 17(3.2,-2.925) 18(3.2,-2.275) 19(3.2,-1.625) 20(3.2,-0.975) 21(3.2,-0.325) 22(3.2,0.325) 23(3.2,0.975) 24(3.2,1.625) 25(3.2,2.275) 26(3.2,2.925) 27(3.2,3.575) 28(3.2,4.225)
USB-C-SMD_10P-P1.00-L6.8-W8.9
  oval 1.1x1.8 hole 0.6x1.2: 0(-4.32,1.75) 0(-4.32,-2.05) 0(4.32,1.75) 0(4.32,-2.05)
  rect 0.8x1.2 smd: 1(-2.749,2.05) 6(2.749,2.05)
  rect 0.76x1.2 smd: 2(-1.52,2.05) 5(1.52,2.05)
  rect 0.7x1.2 smd: 3(-0.5,2.05) 4(0.5,2.05)

## Nets
As in the schematic, except:
SCL: PCA-A.26 PCA-B.26 PCA-C.26 PCA-D.26 R24.2 U1.6
SDA: PCA-A.27 PCA-B.27 PCA-C.27 PCA-D.27 R23.2 U1.5

## Via types
v1: diameter 0.61, hole 0.305, Top Layer to Bottom Layer, 126 vias

## Routing (per net, layer and track width the routed paths; a pad name or vN(x,y) marks a point on that pad's centre or on a via; arc(x,y) is an arc through that point)
GND: length 762.1
  Top Layer w0.406: 26.7,93.8 26.7,92 16.97,82.28 PCA-C.25 ; PCA-D.14 43.32,14.5 43.6,14.22 43.6,11.7 ; v1(37,5.2) 38.2,4 R26.1 ; R4.2 82.8,11.5 64.9,29.4 ; v1(27.56,16.44) 27.56,20.86 PCA-D.25 ; 14.7,43.8 14.7,69.6 9.3,75 PCA-C.14 ; v1(82.97,79.1) 85.37,79.1 87.07,77.4 ; R13.1 81.3,94.8 81.3,93.37 81.9,92.77 v1(81.9,90.37) ; v1(34.16,6.84) 32.96,8.04 31.47,8.04 USB2.6 ; PCA-B.25 84.78,22.9 83.67,24 81.27,24 78.27,27 78.27,28.2 72.77,33.7 72.6,33.7 ; 87.07,77.4 87.07,78 87.68,78.6 88.28,78.6 90.4,76.48 90.4,75.92 88.28,73.8 88.28,69.6 88.88,69 88.88,67.8 ; 87.07,77.4 PCA-A.25 ; 88.8,67.8 R28.2 ; 80.57,82.7 v1(79.97,82.1)
  Top Layer w0.6: R25.1 42.7,11.7 45.4,11.7 50.2,16.5 53.2,16.5 ; 76.4,50.8 76.4,50.1 B8.1 73,46.7 ; 76.4,50.8 76.9,50.8 77.5,51.4 79.3,51.4 82.5,54.6 B3.1 84.5,56 88.1,56 ; 76.4,50.8 B9.1 74.2,56.7 B10.1 73.3,60.7 A11.1 70,64 A10.1 67.6,67.1 ; 38.7,28.4 38.7,28 D12.1 ; 38.7,28.4 v1(39.9,27.2) ; 38.7,28.4 38.7,29.6 38.1,30.2 35.9,30.2 34.7,31.4 ; 44.5,85.4 44.5,87.8 A2.1 44.3,92.2 A1.1 45.1,94.5 A0.1 ; 44.5,85.4 44.5,84.2 A3.1 45.7,81.4 A4.1 46.4,75.9 A5.1 ; 44.5,85.4 35.1,85.4 ; 28.7,38.8 31.1,36.4 31.1,34.5 D14.1 32.8,33.3 32.9,33.2 34.1,33.2 ; 28.7,38.8 28.7,40 27.1,41.6 27.1,42.8 ; 28.7,38.8 28.7,38.4 D15.1 ; 88.1,56 B2.1 92.7,55.9 B1.1 94.3,55.1 B0.1 98.7,50.7 98.7,44.7 R8.1 94.4,41.6 92.6,41.6 92,41 ; 88.1,56 88.1,56.9 87.5,57.5 R28.2 ; R16.1 R15.1 R14.1 78.93,94.57 81.3,94.57 ; 27.1,42.8 C10.1 25.8,41.5 21.8,41.5 C12.1 17.1,43.8 13.2,43.8 C13.1 12.4,44.2 7.8,44.2 ; 27.1,42.8 27.1,44.9 26.5,45.5 C9.1 26.7,47.5 26.7,48.6 ; 50.3,22.3 52.7,22.3 53.2,21.8 D3.1 53.2,16.5 ; 50.3,22.3 50.3,21.3 D4.1 ; 50.3,22.3 50.3,24.7 ; 43.1,55.1 42.6,55.6 C2.1 39.8,54.4 38.1,54.4 36.3,56.2 ; 43.1,55.1 43.7,55.1 48.5,59.9 C16.2 ; 43.1,55.1 C1.1 45.9,52.7 C0.1 51.2,47.4 B15.1 54.8,44.7 B14.1 60.4,44.7 B13.1 62.2,42.9 65.5,42.9 ; D10.1 48.9,24.7 50.3,24.7 ; 50.3,24.7 52.7,24.7 D5.1 54.3,25.5 D6.1 60.1,27.7 D7.1 63.3,28.8 64.3,28.8 D8.1 66.1,32.7 64.3,34.5 64.3,41.7 65.5,42.9 ; 55.6,10.5 52.8,7.7 52.8,7.1 ; 55.6,10.5 56.8,10.5 57.4,11.1 57.4,12.9 56.8,13.5 56.2,13.5 53.2,16.5 ; 55.6,10.5 D2.1 ; 67.6,67.1 62.7,62.2 R18.2 59.1,62.2 R17.2 ; 67.6,67.1 A9.1 64.1,70.6 A8.1 60.9,72.8 A7.1 ; 73,46.7 73,43.4 B7.1 72,41 B6.1 72,36 72.6,35.4 72.6,33.7 72,33.1 70.4,33.1 D9.1 69.2,35.9 B5.1 ; 73,46.7 70.8,46.7 B11.1 68.1,45.5 B12.1 65.5,42.9 ; C4.1 28.6,57.5 ; C4.1 34.6,54.5 36.3,56.2 ; C4.1 29.9,52.8 C8.1 26.7,48.6 ; 28.6,57.5 28.6,60.7 C6.1 ; 28.6,57.5 C7.1 ; 34.1,33.2 34.7,33.2 R29.2 42.5,38.5 R30.2 ; 34.1,33.2 34.7,32.6 34.7,31.4 ; 92,41 92,36.5 R7.1 R2.1 ; 92,41 R6.1 ; A5.1 47.6,73.4 52.8,73.4 A6.1 ; A5.1 45.9,75.1 42.9,75.1 A12.1 39.2,73.9 A13.1 35.9,71.9 A14.1 30,66 30,65.7 ; 7.8,44.2 7.12,43.52 U1.13 ; 7.8,44.2 C14.1 5.7,44.4 C15.1 ; R11.2 91.2,67.8 88.88,67.8 ; 36.3,56.2 36.3,56.8 C3.1 34.8,58.3 C5.1 31.8,64.5 31.2,64.5 30,65.7 ; R26.1 R27.1 46.9,5.9 v1(51.6,5.9) 52.8,7.1 ; 30,65.7 A15.1 ; 34.7,31.4 34.7,31 D13.1 ; v1(49.8,4.1) 49.8,2.5 D0.1 ; C11.1 21.5,48.6 26.7,48.6 ; USB1.1 69.7,6.74 69.7,6.24 70.3,5.64 74.5,5.64 75.1,6.24 USB1.6 81.1,12.84 81.1,13.2 ; R22.1 R21.1 R20.1 R19.1 26.7,94.3 26.7,93.8 35.1,85.4 ; 52.8,7.1 D1.1 ; 35.1,85.4 R3.2 ; v1(41.2,24.4) D11.1 ; USB2.1 24.87,6.94 24.87,7.44 25.47,8.04 29.67,8.04 30.27,7.44 USB2.6 ; R13.1 R12.1 ; R4.2 R9.2
  Bottom Layer w0.406: 80.57,81.5 82.97,83.9 82.97,89.3 v1(81.9,90.37) ; 80.57,81.5 v1(82.97,79.1) ; 80.57,81.5 v1(79.97,82.1) ; v1(27.56,16.44) 27.56,13.44 v1(34.16,6.84) 35.36,6.84 v1(37,5.2)
  Bottom Layer w0.6: v1(51.6,5.9) v1(49.8,4.1) ; v1(39.9,27.2) 39.9,25.7 v1(41.2,24.4)
VDD: length 229.7
  Top Layer w0.406: PCA-A.28 v1(89.62,76.3) ; v1(87.82,32.5) 87.82,29.3 PCA-B.1 ; PCA-C.2 9.35,83.62 10.9,83.62 11.5,84.22 PCA-C.28 v1(15.7,84.83) ; U2.2 59.45,57.1 68.03,57.1 v1(71.62,60.7) ; 26.22,14.5 PCA-D.1 PCA-D.28 v1(24.97,21.43) ; v1(35.1,64.55) 35.7,64.55 39.9,60.35 46.5,60.35 ; PCA-B.28 86.72,24.2 v1(87.82,25.3)
  Top Layer w0.6: C16.1 46.5,60.35 47.4,61.25 54,61.25 U2.2
  Bottom Layer w0.406: v1(15.7,84.83) 15.7,83.95 v1(35.1,64.55) 42.9,56.75 42.9,39.35 v1(24.97,21.43) ; v1(87.82,25.3) v1(87.82,32.5) 87.82,34.9 90.22,37.3 90.22,75.7 v1(89.62,76.3) 89.62,77.5 88.43,78.7 87.82,78.7 82.43,73.3 82.43,71.5 v1(71.62,60.7)
PCA-A_1: length 11.9
  Top Layer w0.4: PCA-A.1 89.03,92.47 R12.2
PCA-A_2: length 13.7
  Top Layer w0.4: PCA-A.2 88.38,88.12 R13.2
PCA-A_3: length 15.5
  Top Layer w0.4: 87.72,82.7 87.72,83.59 77.72,93.59 77.72,93.78 R14.2
PCA-A_4: length 24.9
  Top Layer w0.4: PCA-A.4 87.07,81.5 v1(87.47,81.1) ; R15.2 72.6,93.9 v1(76.28,93.9)
  Bottom Layer w0.4: v1(87.47,81.1) 87.47,85.9 79.47,93.9 v1(76.28,93.9)
PCA-A_5: length 47
  Top Layer w0.4: PCA-A.5 86.43,81.1 87.22,80.3 88.43,80.3 89.62,81.5 89.62,95.9 88.43,97.1 66.82,97.1 66.43,96.7 66.43,95.08 R16.2
PCA-A_6: length 42.6
  Top Layer w0.4: PCA-A.6 85.78,84.3 77.38,92.7 54.9,92.7 A0.2
PCA-A_7: length 42.8
  Top Layer w0.4: A1.2 48.4,91.9 77.12,91.9 85.12,83.9 PCA-A.7
PCA-A_8: length 46.8
  Top Layer w0.4: PCA-A.8 84.47,81.79 81.78,79.1 78.07,79.1 75.28,81.9 47.28,81.9 46.88,82.3 46.88,87.62 A2.2
PCA-A_9: length 38.4
  Top Layer w0.4: A3.2 49.9,85 82.62,85 83.82,83.8 83.82,82.7
PCA-A_10: length 34.7
  Top Layer w0.4: PCA-A.10 83.18,81.5 81.57,79.9 v1(78.38,79.9) ; v1(71.18,78.3) A4.2
  Bottom Layer w0.4: v1(71.18,78.3) 76.78,78.3 v1(78.38,79.9)
PCA-A_11: length 41.4
  Top Layer w0.4: A5.2 49.72,75.72 49.72,78.7 50.53,79.5 71.72,79.5 v1(72.12,79.1) ; PCA-A.11 82.53,83.9 v1(82.12,84.3)
  Bottom Layer w0.4: v1(72.12,79.1) 75.72,79.1 79.72,83.1 80.93,83.1 v1(82.12,84.3)
PCA-A_12: length 32.6
  Top Layer w0.4: PCA-A.12 81.88,81.5 81.47,81.1 77.07,81.1 v1(76.68,81.5) ; v1(69.07,77.5) 54.7,77.5 A6.2
  Bottom Layer w0.4: v1(69.07,77.5) 71.47,79.9 75.07,79.9 v1(76.68,81.5)
PCA-A_13: length 27.9
  Top Layer w0.4: v1(80.82,84.3) 81.22,83.9 81.22,82.7 ; v1(74.82,80.7) 69.13,75 A7.2
  Bottom Layer w0.4: v1(80.82,84.3) 78.43,84.3 v1(74.82,80.7)
PCA-A_15: length 18.9
  Top Layer w0.4: A8.2 77.07,72.8 80.57,76.3
PCA-A_16: length 17.7
  Top Layer w0.4: A9.2 76.22,70.1 81.22,75.1 81.22,76.3
PCA-A_17: length 16.7
  Top Layer w0.4: A10.2 72.2,69.1 76.28,69.1 81.88,74.7 PCA-A.17
PCA-A_18: length 16.9
  Top Layer w0.4: A11.2 72.93,63.53 72.93,64.7 82.53,74.3 PCA-A.18
PCA-A_19: length 43.3
  Top Layer w0.4: A12.2 45.1,72.7 53.97,72.7 55.18,73.9 70.38,73.9 74.38,77.9 82.78,77.9 83.18,77.5 PCA-A.19
PCA-A_20: length 47.4
  Top Layer w0.4: v1(81.43,71.9) 83.82,74.3 83.82,76.3 ; v1(60.62,71.9) A13.2
  Bottom Layer w0.4: v1(81.43,71.9) v1(60.62,71.9)
PCA-A_21: length 53.4
  Top Layer w0.4: v1(78.57,69.2) 79.78,69.2 84.47,73.9 PCA-A.21 ; v1(64.18,69.2) A14.2
  Bottom Layer w0.4: v1(78.57,69.2) v1(64.18,69.2)
PCA-A_22: length 60
  Top Layer w0.4: v1(74.93,65.7) 75.12,65.9 77.53,65.9 85.12,73.5 PCA-A.22 ; A15.2 33.3,66.9 63.72,66.9 v1(64.93,65.7)
  Bottom Layer w0.4: v1(74.93,65.7) v1(64.93,65.7)
PCA-A_23: length 8.5
  Top Layer w0.4: R28.1 85.78,70.22 PCA-A.23
PCA-A_24: length 11
  Top Layer w0.4: R11.1 89.22,71.78 v1(89.22,73.38) ; v1(86.82,74.58) 86.43,74.97 PCA-A.24
  Bottom Layer w0.4: v1(89.22,73.38) 88.03,74.58 v1(86.82,74.58)
PCA-B_2: length 6.4
  Top Layer w0.4: R2.2 86.07,32.58 PCA-B.2
PCA-B_3: length 13.5
  Top Layer w0.4: R6.2 88.62,39 85.43,35.8 PCA-B.3
PCA-B_4: length 13
  Top Layer w0.4: R7.2 92.38,33.88 92.38,32.28 86.78,26.68 85.1,26.68 84.78,27 PCA-B.4
PCA-B_5: length 21.3
  Top Layer w0.4: R8.2 94.93,38.92 94.93,33.8 86.93,25.8 84.93,25.8 84.12,26.6 PCA-B.5
PCA-B_6: length 27.8
  Top Layer w0.4: PCA-B.6 83.47,36.47 96.68,49.67 97.47,49.67 B0.2
PCA-B_7: length 29.1
  Top Layer w0.4: PCA-B.7 82.82,42.22 B1.2
PCA-B_8: length 28
  Top Layer w0.4: PCA-B.8 82.18,47.67 B2.2
PCA-B_9: length 24.9
  Top Layer w0.4: B3.2 81.53,50.83 PCA-B.9
PCA-B_10: length 21.7
  Top Layer w0.4: B4.2 80.88,47.42 PCA-B.10
PCA-B_11: length 19.8
  Top Layer w0.4: v1(70.22,35.4) 70.22,37.08 B5.2 ; v1(79.82,26.6) 80.22,27 PCA-B.11
  Bottom Layer w0.4: v1(79.82,26.6) 76.62,26.6 71.43,31.8 71.43,34.2 v1(70.22,35.4)
PCA-B_12: length 12.4
  Top Layer w0.4: B6.2 74.38,38.22 74.38,35 79.57,29.8 PCA-B.12
PCA-B_13: length 17.9
  Top Layer w0.4: B7.2 73.32,40.12 73.32,35 78.93,29.4 PCA-B.13
PCA-B_15: length 27.2
  Top Layer w0.4: B8.2 76.8,47.5 76.8,34.47 v1(76.4,34.07) ; 78.27,21.8 76.4,23.67 v1(76.4,28.87)
  Bottom Layer w0.4: v1(76.4,28.87) v1(76.4,34.07)
PCA-B_16: length 33.9
  Top Layer w0.4: B9.2 76.53,52.88 v1(76.53,51.8) ; PCA-B.16 78.93,23.4 v1(78.53,23.8)
  Bottom Layer w0.4: v1(78.53,23.8) 80.53,25.8 80.53,47.8 v1(76.53,51.8)
PCA-B_17: length 37.5
  Top Layer w0.4: B10.2 75.57,57.53 v1(75.57,54.2) ; PCA-B.17 79.57,23.8 77.18,26.2 v1(77.18,27.4)
  Bottom Layer w0.4: v1(75.57,54.2) 75.57,50.6 77.18,49 v1(77.18,27.4)
PCA-B_18: length 36.3
  Top Layer w0.4: PCA-B.18 80.22,20.6 79.82,20.2 78.22,20.2 70.41,28.01 70.41,31.21 65.82,35.8 65.82,39 71.8,44.97 B11.2
PCA-B_19: length 33.2
  Top Layer w0.4: PCA-B.19 80.88,20.2 80.07,19.4 78.07,19.4 69.28,28.2 69.28,31.4 65,35.67 65,40.2 B12.2
PCA-B_20: length 32.2
  Top Layer w0.4: PCA-B.20 81.53,23 81.12,23.4 v1(80.32,23.4) ; B13.2 61.5,36.22 v1(64.32,33.4)
  Bottom Layer w0.4: v1(64.32,33.4) 67.93,33.4 78.32,23 79.93,23 v1(80.32,23.4)
PCA-B_21: length 41.3
  Top Layer w0.4: PCA-B.21 82.18,20.6 80.18,18.6 77.78,18.6 68.18,28.2 v1(68.18,29.4) ; v1(61.78,33.4) 56.4,38.78 B14.2
  Bottom Layer w0.4: v1(61.78,33.4) 62.57,32.6 66.18,32.6 68.18,30.6 v1(68.18,29.4)
PCA-B_22: length 47.7
  Top Layer w0.4: v1(66.03,29.4) 77.62,17.8 80.43,17.8 82.82,20.2 PCA-B.22 ; v1(64.82,30.6) 64.82,31.4 57.62,38.6 57.62,43 56.82,43.8 53.5,43.8 B15.2
  Bottom Layer w0.4: v1(66.03,29.4) v1(64.82,30.6)
PCA-B_23: length 13.4
  Top Layer w0.4: R9.1 90.1,13.5 83.47,20.12 PCA-B.23
PCA-B_24: length 21.9
  Top Layer w0.4: PCA-B.24 84.12,20.6 90.3,14.43 93.5,14.43 93.9,14.03 93.9,12.82 93.5,12.43 88.57,12.43 R4.1
PCA-C_1: length 19.7
  Top Layer w0.4: PCA-C.1 18.1,93.03 24.03,93.03 R19.2
PCA-C_3: length 19
  Top Layer w0.4: R20.2 17.58,94 7.7,84.12 7.7,83.33 8.1,82.92 PCA-C.3
PCA-C_4: length 17
  Top Layer w0.4: R21.2 6.9,85.9 6.9,83.08 7.7,82.28 PCA-C.4
PCA-C_5: length 16.5
  Top Layer w0.4: R22.2 6.1,90.1 6.1,82.83 7.3,81.62 PCA-C.5
PCA-C_6: length 56.1
  Top Layer w0.4: v1(12.1,82.58) 10.5,80.97 PCA-C.6 ; C0.2 46.62,49.78 v1(46.62,50.58) ; v1(44.22,57.38) 41.03,57.38 v1(34.22,64.17)
  Bottom Layer w0.4: v1(34.22,64.17) 14.62,83.78 13.3,83.78 v1(12.1,82.58) ; v1(44.22,57.38) 44.22,52.97 v1(46.62,50.58)
PCA-C_7: length 45.4
  Top Layer w0.4: PCA-C.7 11.7,80.33 v1(12.5,79.53) ; v1(41.3,54.33) 41.68,54.33 C1.2
  Bottom Layer w0.4: v1(41.3,54.33) 16.1,79.53 v1(12.5,79.53)
PCA-C_8: length 41.7
  Top Layer w0.4: C2.2 38.8,57.78 v1(36.1,60.47) ; v1(11.3,79.28) 10.9,79.67 PCA-C.8
  Bottom Layer w0.4: v1(11.3,79.28) 12.5,80.47 16.1,80.47 v1(36.1,60.47)
PCA-C_9: length 41.1
  Top Layer w0.4: v1(7.7,79.42) 8.1,79.03 PCA-C.9 ; C3.2 33.9,57.23 29.3,61.83 26.9,61.83 v1(26.1,61.03)
  Bottom Layer w0.4: v1(7.7,79.42) 12.1,75.03 12.1,69.83 20.1,61.83 25.3,61.83 v1(26.1,61.03)
PCA-C_10: length 42.1
  Top Layer w0.4: v1(22.9,57.97) 22.9,57.17 23.58,56.5 23.58,52.1 23.98,51.7 25.18,51.7 25.58,52.1 25.58,53.3 26.78,54.5 C4.2 ; PCA-C.10 8.1,78.38 7.7,77.97 v1(7.7,77.17)
  Bottom Layer w0.4: v1(7.7,77.17) 7.7,73.17 v1(22.9,57.97)
PCA-C_11: length 31
  Top Layer w0.4: C5.2 29.97,64.12 v1(26.1,64.12) ; PCA-C.11 10.9,77.72 11.7,76.92 11.7,75.33 v1(17.3,69.72)
  Bottom Layer w0.4: v1(26.1,64.12) 20.5,69.72 v1(17.3,69.72)
PCA-C_12: length 26.4
  Top Layer w0.4: v1(17.3,68.28) 10.9,74.67 10.9,76.67 10.5,77.08 PCA-C.12 ; C6.2 28.62,63.08 v1(26.1,63.08)
  Bottom Layer w0.4: v1(26.1,63.08) 20.9,68.28 v1(17.3,68.28)
PCA-C_13: length 29.9
  Top Layer w0.4: v1(12.1,67.8) 7.7,72.2 7.7,76.03 8.1,76.42 PCA-C.13 ; v1(23.6,57.5) C7.2
  Bottom Layer w0.4: v1(12.1,67.8) 22.8,57.1 23.2,57.1 v1(23.6,57.5)
PCA-C_15: length 28.3
  Top Layer w0.4: C8.2 24.5,54.57 26.5,56.58 26.5,58.58 24.1,60.97 24.1,67.38 PCA-C.15
PCA-C_16: length 34.6
  Top Layer w0.4: C9.2 24.62,47.62 v1(25.3,47.62) ; v1(25.3,60.83) 24.9,61.22 24.9,68.42 16.9,76.42 PCA-C.16
  Bottom Layer w0.4: v1(25.3,60.83) v1(25.3,47.62)
PCA-C_17: length 43.2
  Top Layer w0.4: PCA-C.17 14.5,77.08 14.1,76.67 14.1,75.88 22.1,67.88 22.1,53.08 22.9,52.28 22.9,50.67 22.1,49.88 20.9,49.88 20.1,49.08 20.1,47.4 C10.2
PCA-C_18: length 32.1
  Top Layer w0.4: PCA-C.18 14.1,77.72 13.3,76.92 13.3,75.72 21.3,67.72 21.3,51 C11.2
PCA-C_19: length 36.1
  Top Layer w0.4: PCA-C.19 13.7,78.38 12.5,77.17 12.5,75.58 18.3,69.78 C12.2
PCA-C_20: length 35.7
  Top Layer w0.4: v1(13,78.72) 13.3,79.03 PCA-C.20 ; v1(13,70.33) C13.2
  Bottom Layer w0.4: v1(13,78.72) v1(13,70.33)
PCA-C_21: length 43.5
  Top Layer w0.4: v1(12.1,81.28) 13.7,79.67 PCA-C.21 ; C14.2 7.6,50.58 6.9,51.28 v1(6.9,79.67)
  Bottom Layer w0.4: v1(12.1,81.28) 8.5,81.28 v1(6.9,79.67)
PCA-C_22: length 51.1
  Top Layer w0.4: v1(13.7,69.53) 14.03,69.2 14.03,45.19 13.73,44.9 12.03,44.9 v1(8.42,48.5) ; v1(6.83,49.3) C15.2 ; PCA-C.22 16.9,80.33 17.3,79.92 v1(17.3,77.12)
  Bottom Layer w0.4: v1(13.7,69.53) 17.3,73.12 v1(17.3,77.12) ; v1(8.42,48.5) 7.62,48.5 v1(6.83,49.3)
PCA-C_23: length 55.3
  Top Layer w0.4: v1(56.5,60.17) 62.38,60.17 R18.1 ; v1(31.7,68.97) 19.7,80.97 PCA-C.23
  Bottom Layer w0.4: v1(31.7,68.97) 40.5,60.17 v1(56.5,60.17)
PCA-C_24: length 47.3
  Top Layer w0.4: v1(43.62,63.7) R17.1 ; v1(33.3,70.42) 22.1,81.62 PCA-C.24
  Bottom Layer w0.4: v1(33.3,70.42) 36.9,70.42 v1(43.62,63.7)
PCA-D_3: length 20.3
  Top Layer w0.4: R25.2 41.9,12.9 v1(40.07,12.9) ; PCA-D.3 v1(26.88,16.9)
  Bottom Layer w0.4: v1(40.07,12.9) 39.68,12.9 35.28,17.3 27.28,17.3 v1(26.88,16.9)
PCA-D_4: length 17.2
  Top Layer w0.4: PCA-D.4 27.53,12.5 31.12,8.9 37.1,8.9 R26.2
PCA-D_5: length 21
  Top Layer w0.4: R27.2 41.3,9.7 31.78,9.7 28.18,13.3 PCA-D.5
PCA-D_6: length 31.1
  Top Layer w0.4: v1(47.22,2.5) 48.43,1.3 50.8,1.3 D0.2 ; 28.82,14.5 v1(28.82,16.1)
  Bottom Layer w0.4: v1(28.82,16.1) 42.43,2.5 v1(47.22,2.5)
PCA-D_7: length 30.7
  Top Layer w0.4: PCA-D.7 29.47,15.7 v1(29.88,16.1) ; v1(53.88,6.9) 54.9,6.9 D1.2
  Bottom Layer w0.4: v1(29.88,16.1) 39.07,6.9 v1(53.88,6.9)
PCA-D_8: length 30.4
  Top Layer w0.4: PCA-D.8 30.12,13.3 33.12,10.3 50.32,10.3 53.12,13.1 55.2,13.1 D2.2
PCA-D_9: length 30.5
  Top Layer w0.4: v1(54.18,17.1) D3.2 ; PCA-D.9 v1(30.78,16.5)
  Bottom Layer w0.4: v1(54.18,17.1) 49.18,12.1 35.18,12.1 v1(30.78,16.5)
PCA-D_10: length 25.1
  Top Layer w0.4: D4.2 51,19.8 49.53,19.8 48.42,20.9 36.62,20.9 31.43,15.7 PCA-D.10
PCA-D_11: length 34.5
  Top Layer w0.4: PCA-D.11 32.07,13.3 34.07,11.3 v1(40.47,11.3) ; D5.2 54.07,23.53 v1(54.07,18.28)
  Bottom Layer w0.4: v1(54.07,18.28) 54.88,17.47 54.88,16.68 49.5,11.3 v1(40.47,11.3)
PCA-D_12: length 32.9
  Top Layer w0.4: 32.72,14.5 32.72,15.7 37.12,20.1 v1(47.93,20.1) ; v1(55.1,20.1) 55.1,20.5 D6.2
  Bottom Layer w0.4: v1(47.93,20.1) v1(55.1,20.1)
PCA-D_13: length 38.5
  Top Layer w0.4: D7.2 56,19.3 v1(54.97,19.3) ; v1(40.18,13.7) 38.97,13.7 38.18,12.9 33.78,12.9 33.38,13.3 PCA-D.13
  Bottom Layer w0.4: v1(54.97,19.3) 45.78,19.3 v1(40.18,13.7)
PCA-D_15: length 38.9
  Top Layer w0.4: PCA-D.15 36.43,23.3 44.82,23.3 v1(45.22,23.7) ; v1(67.12,30.6) D8.2
  Bottom Layer w0.4: v1(67.12,30.6) 66.43,31.3 52.82,31.3 v1(45.22,23.7)
PCA-D_16: length 46.3
  Top Layer w0.4: D9.2 71.2,34.1 v1(70.57,34.1) ; PCA-D.16 33.38,19.7 33.78,19.3 34.18,19.3 37.38,22.5 46.18,22.5 47.38,23.7 47.38,24.9 56.57,34.1 v1(59.78,34.1)
  Bottom Layer w0.4: v1(59.78,34.1) v1(70.57,34.1)
PCA-D_17: length 16.6
  Top Layer w0.4: D10.2 45.5,25.3 35.93,25.3 32.72,22.1 32.72,20.9
PCA-D_18: length 13.4
  Top Layer w0.4: PCA-D.18 32.07,22.5 35.47,25.89 41.49,25.89 D11.2
PCA-D_19: length 10.6
  Top Layer w0.4: PCA-D.19 31.43,22.93 D12.2
PCA-D_20: length 12.2
  Top Layer w0.4: PCA-D.20 30.78,29.28 D13.2
PCA-D_21: length 29.5
  Top Layer w0.4: D14.2 28.3,33.9 v1(28.3,26.72) ; v1(24.3,22.72) 24.3,17.93 v1(24.7,17.53) ; PCA-D.21 30.12,19.9 30.32,19.7 30.53,19.7 v1(30.93,19.3)
  Bottom Layer w0.4: v1(24.7,17.53) 25.1,17.93 29.55,17.93 v1(30.93,19.3) ; v1(24.3,22.72) v1(28.3,26.72)
PCA-D_22: length 20.6
  Top Layer w0.4: D15.2 26.3,38.2 26.3,27.68 29.88,24.1 29.88,22.9 29.47,22.5 PCA-D.22
PCA-D_23: length 22.6
  Top Layer w0.4: 28.82,20.9 v1(28.82,22.62) ; v1(37.22,31.03) 42.03,31.03 R30.1
  Bottom Layer w0.4: v1(28.82,22.62) v1(37.22,31.03)
PCA-D_24: length 20.7
  Top Layer w0.4: PCA-D.24 28.18,22.5 27.97,22.7 27.97,23.1 v1(28.57,23.7) ; R29.1 36.18,32.67 v1(36.18,31.3)
  Bottom Layer w0.4: v1(28.57,23.7) v1(36.18,31.3)
R1_2: length 75.2
  Top Layer w0.4: v1(50.6,49.2) 52.2,49.2 57.8,54.8 57.8,55.2 58.2,55.6 64.6,55.6 R1.2 ; v1(33.4,34) 47.4,48 v1(49.4,48) ; v1(15.4,16) 9.66,10.26 U1.3
  Bottom Layer w0.4: v1(33.4,34) v1(15.4,16) ; v1(50.6,49.2) v1(49.4,48)
R5_1: length 105.1
  Top Layer w0.4: R5.1 34.4,83.9 R3.1 ; v1(12.2,11.8) U1.4
  Bottom Layer w0.4: R5.1 24.3,85.5 11.5,85.5 6.2,80.2 6.2,72.6 12.2,66.6 v1(12.2,11.8)
R5_2: length 141.7
  Top Layer w0.4: U1.12 9.7,25.74 R23.1 8.3,35.3 8.3,41.7 v1(9.5,42.9) ; v1(5.5,36.1) 5.5,35.1 R24.1 ; v1(56.8,57.3) U2.3
  Bottom Layer w0.4: v1(56.8,57.3) 57.2,57.7 57.2,60.5 30.4,87.3 R5.2 10.3,87.3 4.3,81.3 4.3,50.1 9.5,44.9 v1(9.5,42.9) 9.5,40.1 v1(5.5,36.1)
SCL: length 278.4
  Top Layer w0.4: v1(14.12,82.92) PCA-C.26 ; 87.72,76.3 87.72,74.3 87.32,73.9 v1(87.32,73.1) ; v1(18.72,12.5) 17.28,11.06 U1.6 17.28,9.13 15.68,7.53 3.9,7.53 3.1,8.34 3.1,34.7 R24.2 ; PCA-B.26 85.43,20.6 85.82,20.2 86.62,20.2 87.72,21.3 v1(87.72,24.1) ; v1(26.72,19.7) 26.88,19.85 PCA-D.26
  Bottom Layer w0.4: v1(14.12,82.92) 14.47,82.92 34.1,63.3 34.5,63.3 42.1,55.7 42.1,41.7 15.92,15.53 15.92,14.1 17.53,12.5 v1(18.72,12.5) 25.92,19.7 v1(26.72,19.7) 27.92,20.9 83.12,20.9 86.93,24.7 86.93,24.9 ; 86.93,24.9 86.93,72.7 v1(87.32,73.1) ; 86.93,24.9 v1(87.72,24.1)
SDA: length 226
  Top Layer w0.4: 9.85,35.75 10.25,36.15 v1(10.25,43.35) ; 9.85,35.75 12.62,35.75 26.22,22.15 26.22,21.75 ; 9.85,35.75 R23.2 ; 26.22,21.75 26.22,20.9 ; 26.22,21.75 26.88,22.4 v1(27.28,22.4) ; PCA-A.27 88.38,77.5 v1(87.97,77.9) ; v1(12.65,86.55) 15.05,86.55 17.05,84.55 17.05,83.75 16.87,83.58 PCA-C.27 ; U1.5 14.74,9.87 v1(18.08,13.2) ; v1(86.07,24.8) PCA-B.27
  Bottom Layer w0.4: v1(12.65,86.55) 12.25,86.15 11.05,86.15 5.45,80.55 5.45,71.75 10.25,66.95 v1(10.25,43.35) ; v1(18.08,13.2) v1(27.28,22.4) 28.07,21.6 82.88,21.6 v1(86.07,24.8) 86.07,76 v1(87.97,77.9)
U2_1: length 6.4
  Top Layer w0.4: U2.1 64.45,54.55 R1.1
USB1_0: length 16.2
  Bottom Layer w0.6: USB1.0 USB1.0 USB1.0 USB1.0
USB1_2: length 89.1
  Top Layer w0.6: USB1.5 73.87,7.44 73.27,8.04 70.87,8.04 ; USB2.2 26.04,6.8 26.04,5.64 ; 70.87,8.04 58.27,8.04 55.27,5.04 48.67,5.04 46.27,2.64 35.47,2.64 33.07,5.04 30.24,5.04 29.04,6.24 ; 70.87,8.04 70.87,6.88 USB1.2 ; 26.04,5.64 25.44,5.04 22.84,5.04 21.64,6.24 21.64,11.04 9.04,23.64 6.04,23.64 4.58,25.1 U1.14 ; 26.04,5.64 28.44,5.64 29.04,6.24 ; 29.04,6.24 USB2.5
USB2_0: length 16.2
  Bottom Layer w0.6: USB2.0 USB2.0 USB2.0 USB2.0

## Text on the board
Bottom Silkscreen Layer: ©2025 by Jeffrey Beman
